# Altium project Pi Zero Avionics Rev3.PrjPCB (part 1 of 2)
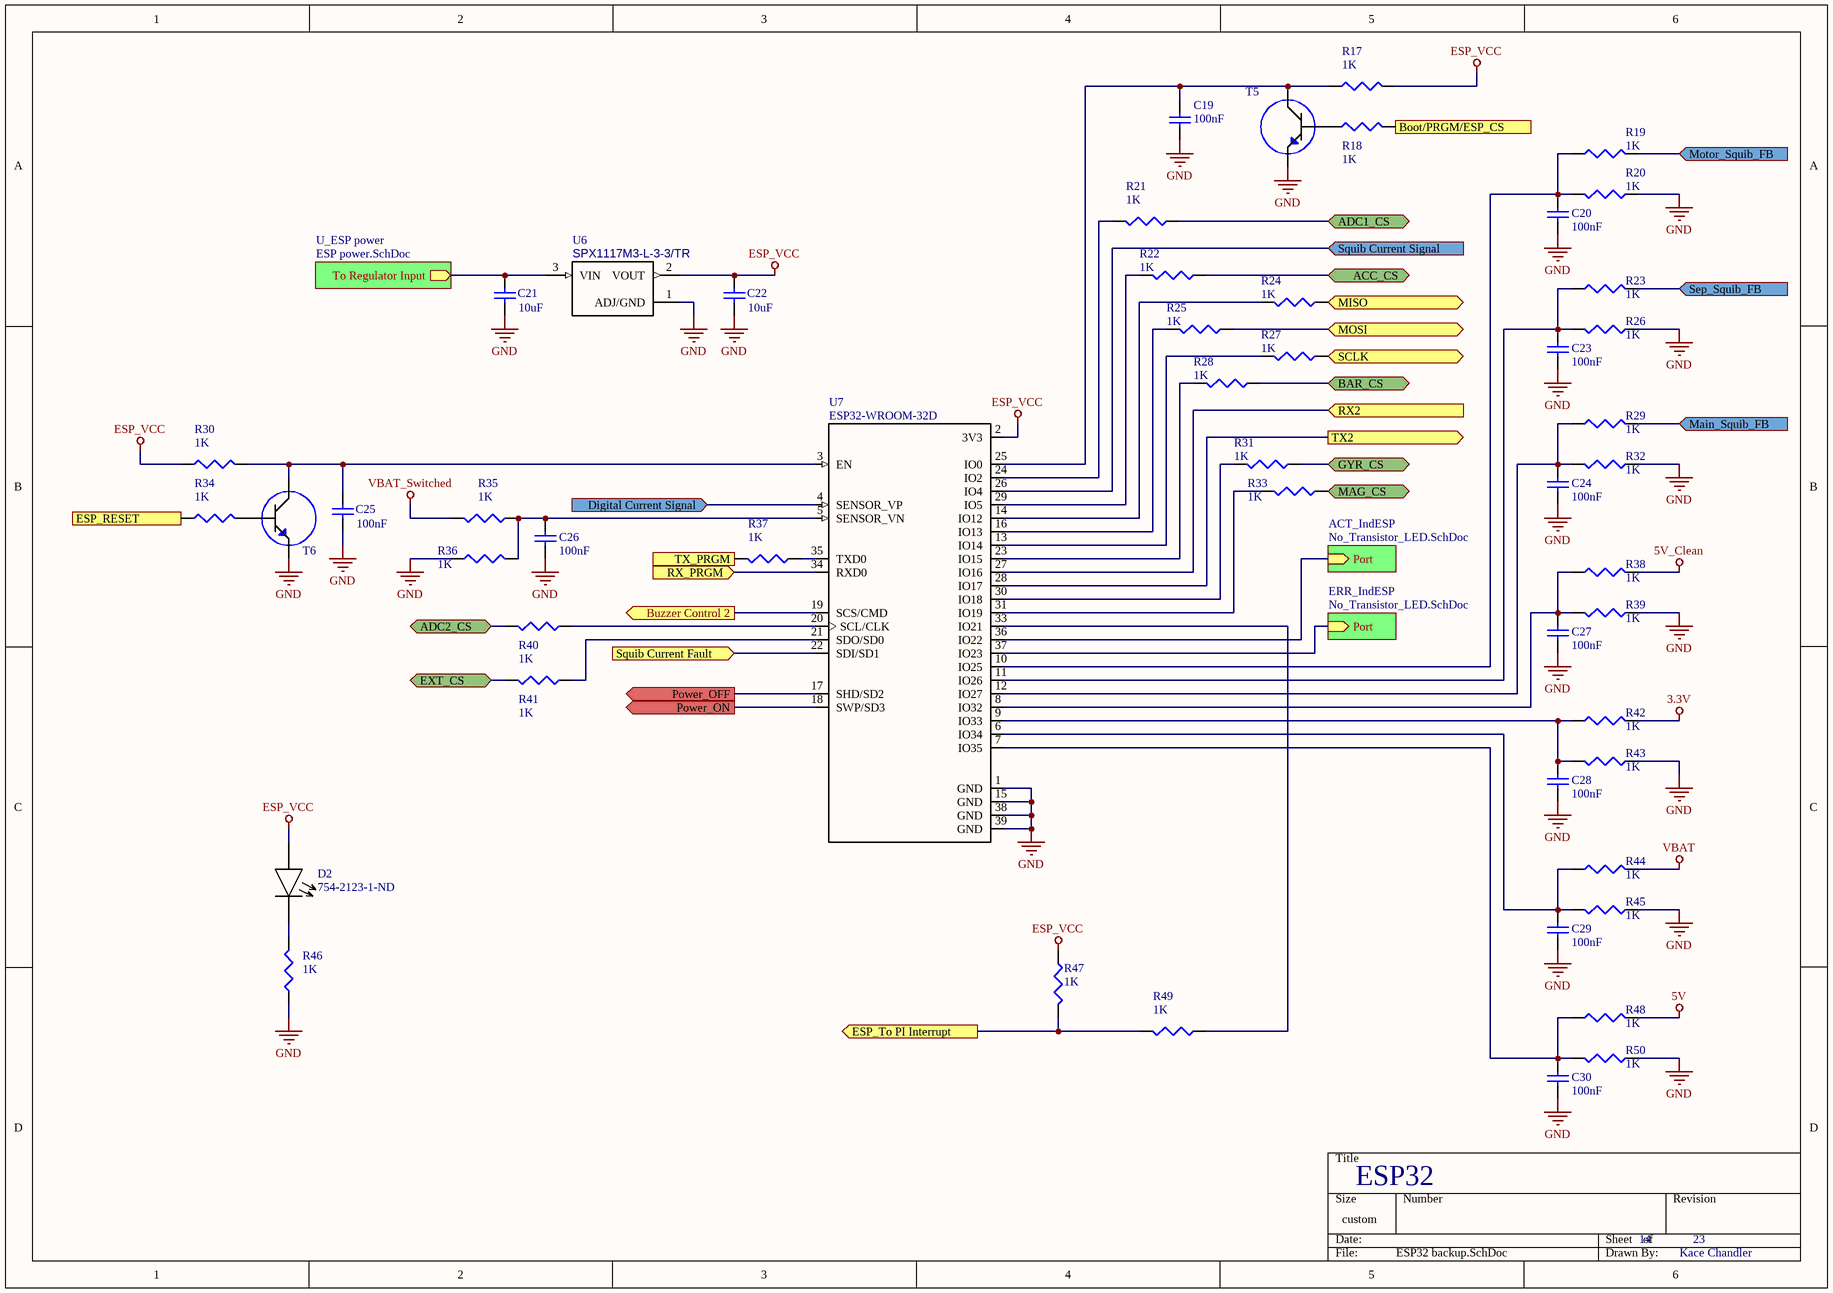
[diagram p0: ESP32 backup.SchDoc]
24 sheets, 377 parts. Net scope: hierarchical (ports join the sheet entries above them; power ports are global).
Board files: HAT PCB.PcbDoc, Main.PcbDoc
Sheets:
  ESP32 backup.SchDoc
    U_ESP power = ESP power.SchDoc
    ACT_IndESP = No_Transistor_LED.SchDoc
    ERR_IndESP = No_Transistor_LED.SchDoc
  Main.SchDoc
    Buzzer = Buzzer.SchDoc
    Sensor Array = Sensors.SchDoc
      Accelerometer = Accelerometer.SchDoc
      Barometer = Barometer.SchDoc
      Gyroscope = Gyroscope.SchDoc
      Magnetometer = Magnetometer.SchDoc
      ADC 1 = ADC.SchDoc
        AIN2 = ADC RC Network.SchDoc
        AIN3 = ADC RC Network.SchDoc
        AIN0 = ADC RC Network.SchDoc
        AIN1 = ADC RC Network.SchDoc
      ADC 2 = ADC.SchDoc
        AIN2 = ADC RC Network.SchDoc
        AIN3 = ADC RC Network.SchDoc
        AIN0 = ADC RC Network.SchDoc
        AIN1 = ADC RC Network.SchDoc
    PWR = Power Managment.SchDoc
      U_Power IO = Power IO.SchDoc
      Regulators = Regulators.SchDoc
    ESP = ESP32.SchDoc
      U_ESP power = ESP power.SchDoc
      ACT_IndESP = No_Transistor_LED.SchDoc
      ERR_IndESP = No_Transistor_LED.SchDoc
    UART = 3 way uart switch.SchDoc
    Squib_Managment = Squib_Managment.SchDoc
      Main_Squib = Squibs.SchDoc
        Voltage_Indicator = Transistor_LED.SchDoc
      Sep_Squib = Squibs.SchDoc
        Voltage_Indicator = Transistor_LED.SchDoc
      Motor_Squib = Squibs.SchDoc
        Voltage_Indicator = Transistor_LED.SchDoc
    ERR_IndPi = No_Transistor_LED.SchDoc
    Main_IND = No_Transistor_LED_INV.SchDoc
    Motor_IND = No_Transistor_LED_INV.SchDoc
    Sep_IND = No_Transistor_LED_INV.SchDoc
    ACT_IND = No_Transistor_LED_INV.SchDoc
    SPI Output = SPI Output.SchDoc
    ESP UART Output = UART Output.SchDoc
    UART EXT = UART Output.SchDoc
    U_EEPROM = EEPROM.SchDoc

## Sheet ESP32 backup.SchDoc: ESP32
size 342 x 241 mm; DrawnBy: Kace Chandler; DocumentNumber: 14; SheetNumber: 14; SheetTotal: 23

### Parts
C19  value 100nF  [0805 Footprint]  (hidden comment: Cap)
C20  value 100nF  [0603 Footprint]  (hidden comment: Cap)
C21  value 10uF  [0805 Footprint]  (hidden comment: Cap)
C22  value 10uF  [0805 Footprint]  (hidden comment: Cap)
C23  value 100nF  [0603 Footprint]  (hidden comment: Cap)
C24  value 100nF  [0603 Footprint]  (hidden comment: Cap)
C25  value 100nF  [0805 Footprint]  (hidden comment: Cap)
C26  value 100nF  [0603 Footprint]  (hidden comment: Cap)
C27  value 100nF  [0603 Footprint]  (hidden comment: Cap)
C28  value 100nF  [0603 Footprint]  (hidden comment: Cap)
C29  value 100nF  [0603 Footprint]  (hidden comment: Cap)
C30  value 100nF  [0603 Footprint]  (hidden comment: Cap)
D2  Supplier Part Number 1: 754-2123-1-ND  [0402 footprint]  (hidden comment: LED_R)
R17  value 1K  (hidden comment: Res3)
R18  value 1K  (hidden comment: Res3)
R19  value 1K  (hidden comment: Res3)
R20  value 1K  (hidden comment: Res3)
R21  value 1K  (hidden comment: Res3)
R22  value 1K  (hidden comment: Res3)
R23  value 1K  (hidden comment: Res3)
R24  value 1K  (hidden comment: Res3)
R25  value 1K  (hidden comment: Res3)
R26  value 1K  (hidden comment: Res3)
R27  value 1K  (hidden comment: Res3)
R28  value 1K  (hidden comment: Res3)
R29  value 1K  (hidden comment: Res3)
R30  value 1K  (hidden comment: Res3)
R31  value 1K  (hidden comment: Res3)
R32  value 1K  (hidden comment: Res3)
R33  value 1K  (hidden comment: Res3)
R34  value 1K  (hidden comment: Res3)
R35  value 1K  (hidden comment: Res3)
R36  value 1K  (hidden comment: Res3)
R37  value 1K  (hidden comment: Res3)
R38  value 1K  (hidden comment: Res3)
R39  value 1K  (hidden comment: Res3)
R40  value 1K  (hidden comment: Res3)
R41  value 1K  (hidden comment: Res3)
R42  value 1K  (hidden comment: Res3)
R43  value 1K  (hidden comment: Res3)
R44  value 1K  (hidden comment: Res3)
R45  value 1K  (hidden comment: Res3)
R46  value 1K  (hidden comment: Res3)
R47  value 1K  [J1-0603]  (hidden comment: Res3)
R48  value 1K  (hidden comment: Res3)
R49  value 1K  (hidden comment: Res3)
R50  value 1K  (hidden comment: Res3)
T5  MMBT2222ALT1  [BJT]  (value not drawn)
T6  MMBT2222ALT1  [BJT]  (value not drawn)
U6  MP: SPX1117M3-L-3-3/TR  [*DPAK229P990X238-4N]  (hidden comment: 3.3V Regulator)
U7  ESP32-WROOM-32D  [*MODULE_ESP32-WROOM-32D]

### Sub-sheets
ACT_IndESP = No_Transistor_LED.SchDoc: Port (in)
ERR_IndESP = No_Transistor_LED.SchDoc: Port (in)
U_ESP power = ESP power.SchDoc: To Regulator Input (out)

### Ports
ACC_CS (bidir), ADC1_CS (bidir), ADC2_CS (bidir), BAR_CS (bidir), Boot/PRGM/ESP_CS (in), Buzzer Control 2 (out), Digital Current Signal (in), ESP_RESET (in), ESP_To PI Interrupt (out), EXT_CS (bidir), GYR_CS (bidir), MAG_CS (bidir), Main_Squib_FB (in), MISO (bidir), MOSI (bidir), Motor_Squib_FB (in), Power_OFF (out), Power_ON (out), RX2 (in), RX_PRGM (in), SCLK (bidir), Sep_Squib_FB (in), Squib Current Fault (in), Squib Current Signal (in), TX2 (out), TX_PRGM (out)

### Nets
3.3V: R42.2
5V: R48.2
5V_Clean: R38.2
ESP_VCC: C22.2 D2.1 R17.1 R30.1 R47.1 U6.2(VOUT) U7.2(3V3)
GND: C19.1 C20.1 C21.1 C22.1 C23.1 C24.1 C25.1 C26.1 C27.1 C28.1 C29.1 C30.1 R20.1 R26.1 R32.1 R36.1 R39.1 R43.1 R45.1 R46.1 R50.1 T5.2(E) T6.2(E) U6.1(ADJ/GND) U7.1(GND) U7.15(GND) U7.38(GND) U7.39(GND)
VBAT: R44.2
VBAT_Switched: R35.2
NetC19_2: C19.2 R17.2 T5.3(C) U7.25(IO0)
NetC20_2: C20.2 R19.1 R20.2 U7.10(IO25)
NetC21_2: C21.2 U6.3(VIN) ; sheet U_ESP power/To Regulator Input
NetC23_2: C23.2 R23.1 R26.2 U7.11(IO26)
NetC24_2: C24.2 R29.1 R32.2 U7.12(IO27)
NetC25_2: C25.2 R30.2 T6.3(C) U7.3(EN)
NetC26_2: C26.2 R35.1 R36.2 U7.5(SENSOR_VN)
NetC27_2: C27.2 R38.1 R39.2 U7.8(IO32)
NetC28_2: C28.2 R42.1 R43.2 U7.9(IO33)
NetC29_2: C29.2 R44.1 R45.2 U7.6(IO34)
NetC30_2: C30.2 R48.1 R50.2 U7.7(IO35)
NetD1_ACT_IndESP_1: U7.36(IO22) ; sheet ACT_IndESP/Port
NetD1_ERR_IndESP_1: U7.37(IO23) ; sheet ERR_IndESP/Port
NetD2_2: D2.2 R46.2
NetR18_1: R18.1 T5.1(B)
NetR18_2: R18.2 ; port Boot/PRGM/ESP_CS
NetR19_2: R19.2 ; port Motor_Squib_FB
NetR21_1: R21.1 ; port ADC1_CS
NetR21_2: R21.2 U7.24(IO2)
NetR22_1: R22.1 ; port ACC_CS
NetR22_2: R22.2 U7.29(IO5)
NetR23_2: R23.2 ; port Sep_Squib_FB
NetR24_1: R24.1 ; port MISO
NetR24_2: R24.2 U7.14(IO12)
NetR25_1: R25.1 ; port MOSI
NetR25_2: R25.2 U7.16(IO13)
NetR27_1: R27.1 ; port SCLK
NetR27_2: R27.2 U7.13(IO14)
NetR28_1: R28.1 ; port BAR_CS
NetR28_2: R28.2 U7.23(IO15)
NetR29_2: R29.2 ; port Main_Squib_FB
NetR31_1: R31.1 ; port GYR_CS
NetR31_2: R31.2 U7.30(IO18)
NetR33_1: R33.1 ; port MAG_CS
NetR33_2: R33.2 U7.31(IO19)
NetR34_1: R34.1 ; port ESP_RESET
NetR34_2: R34.2 T6.1(B)
NetR37_1: R37.1 U7.35(TXD0)
NetR37_2: R37.2 ; port TX_PRGM
NetR40_1: R40.1 U7.20(SCL/CLK)
NetR40_2: R40.2 ; port ADC2_CS
NetR41_1: R41.1 U7.21(SDO/SD0)
NetR41_2: R41.2 ; port EXT_CS
NetR47_2: R47.2 R49.2 ; port ESP_To PI Interrupt
NetR49_1: R49.1 U7.33(IO21)
NetU7_4: U7.4(SENSOR_VP) ; port Digital Current Signal
NetU7_17: U7.17(SHD/SD2) ; port Power_OFF
NetU7_18: U7.18(SWP/SD3) ; port Power_ON
NetU7_19: U7.19(SCS/CMD) ; port Buzzer Control 2
NetU7_22: U7.22(SDI/SD1) ; port Squib Current Fault
NetU7_26: U7.26(IO4) ; port Squib Current Signal
NetU7_27: U7.27(IO16) ; port RX2
NetU7_28: U7.28(IO17) ; port TX2
NetU7_34: U7.34(RXD0) ; port RX_PRGM

### Library data of the parts
C20-C24 C26-C30 = Cap: Capacitor; Published: 8-Jun-2000; LatestRevisionDate: 17-Jul-2002; LatestRevisionNote: Re-released for DXP Platform.; PackageReference: RAD-0.3; Publisher: Altium Limited; PackageDescription: Radial Cap, Thru-Hole; 2 Leads; 0.3 in Pin Spacing
R17-R50 = Res3: Resistor; Published: 8-Jun-2000; LatestRevisionDate: 29-May-2009; LatestRevisionNote: IPC-7351 Footprint Added.; PackageReference: J1-0603; Publisher: Altium Limited; PackageDescription: Chip Resistor
T5 T6 = BJT NPN: Trans NPN 40V 0.6A SOT23; MF: ON Semiconductor; SnapEDA_Link: https://www.snapeda.com/parts/MMBT2222ALT1/ON%20Semiconductor/view-part/?ref=snap; Price: None; Availability: Unavailable; MP: MMBT2222ALT1; Package: SOT-23 Motorola; Value: *; Supplier 1: Digi-Key; Supplier Part Number 1: MMBT2222ATPMSCT-ND
U6 = 3-3VReg: NCP1117DT33T5GOSCT-ND 3.3V linear regulator; MF: MaxLinear, Inc.; Availability: Unavailable; Price: None; Package: SOT-223 Exar; SnapEDA_Link: https://www.snapeda.com/parts/SPX1117M3-L-3-3/TR/MaxLinear%2C%20Inc./view-part/?ref=snap; Value: *; Supplier 1: Digi-Key; Supplier Part Number 1: NCP1117DT33T5GOSCT-ND
U7 = ESP32-WROOM-32D: IC: SoC; GPIO, I2C, I2S, IR, SD, SDIO, SPI, UART; 2.7Ã·3.6VDC; 20dBm; MF: Espressif Systems; SnapEDA_Link: https://www.snapeda.com/parts/ESP32-WROOM-32D/Espressif%20Systems/view-part/?ref=snap; Availability: Unavailable; Package: Module Espressif Systems; Price: None; MP: ESP32-WROOM-32D; Value: *; Supplier 1: Digi-Key; Supplier Part Number 1: 1904-1023-1-ND
D2 = LED_R: Supplier 1: Digi-Key

## Sheet ESP power.SchDoc: ESP Power Management
size 203 x 127 mm; DrawnBy: Kace Chandler; DocumentNumber: 15; SheetNumber: 15; SheetTotal: 23
Used 2 times, as channels U_ESP power, ESP/U_ESP power. Parts and nets are listed once, with the designators drawn on the sheet.
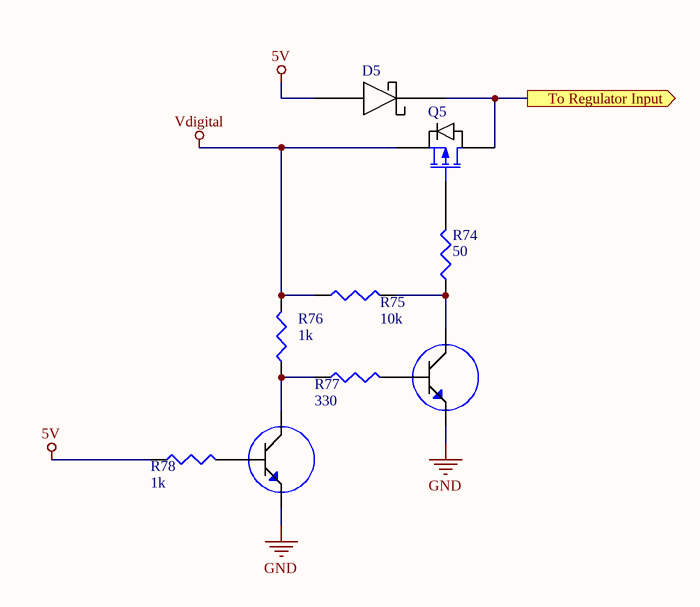
[diagram p1: ESP power.SchDoc]

### Parts
D5  Buck Diode  [*DO-214AC]  (value not drawn)
Q5  P-Channel  [P Channel MOSFET]  (value not drawn)
R74  value 50  [0603 to 0805 SMD]  (hidden comment: Res3)
R75  value 10k  [0603 to 0805 SMD]  (hidden comment: Res3)
R76  value 1k  [0603 to 0805 SMD]  (hidden comment: Res3)
R77  value 330  [0603 to 0805 SMD]  (hidden comment: Res3)
R78  value 1k  [0603 to 0805 SMD]  (hidden comment: Res3)
T10  MMBT2222ALT1  [BJT]  (value not drawn)
T11  MMBT2222ALT1  [BJT]  (value not drawn)

### Ports
To Regulator Input (out)

### Nets
5V: D5.1(A) R78.1
GND: T10.2(E) T11.2(E)
Vdigital: Q5.2(S) R75.1 R76.2
To Regulator Input: D5.2(C) Q5.3(D) ; port To Regulator Input
NetQ5_1: Q5.1(G) R74.2
NetR74_1: R74.1 R75.2 T10.3(C)
NetR76_1: R76.1 R77.1 T11.3(C)
NetR77_2: R77.2 T10.1(B)
NetR78_2: R78.2 T11.1(B)

### Channels
U_ESP power: designators end in _U_ESP_power; ports To Regulator Input=NetC21_2
ESP/U_ESP power: designators end in _ESP_U_ESP_power; ports To Regulator Input=NetC55_2

### Library data of the parts
R74-R78 = Res3: Resistor; Published: 8-Jun-2000; LatestRevisionDate: 29-May-2009; LatestRevisionNote: IPC-7351 Footprint Added.; PackageReference: J1-0603; Publisher: Altium Limited; PackageDescription: Chip Resistor
T10 T11 = BJT NPN: as T5 on sheet ESP32 backup; SnapEDA_Link: https://www.snapeda.com/parts/MMBT2222ALT1/ON%20Semiconductor/view-part/?ref=snap; Price: None; Availability: Unavailable; MP: MMBT2222ALT1; Package: SOT-23 Motorola; Value: *; Supplier 1: Digi-Key; Supplier Part Number 1: MMBT2222ATPMSCT-ND
D5 = Buck Diode: Supplier 1: Digi-Key; Supplier Part Number 1: VSSC8L45-M3/9ATGICT-ND
Q5 = P-Channel: Supplier 1: Digi-Key; Supplier Part Number 1: SI2343CDS-T1-GE3CT-ND

## Sheet No_Transistor_LED.SchDoc: LED
size 203 x 127 mm; DrawnBy: Kace Chandler; DocumentNumber: 16; SheetNumber: 16; SheetTotal: 23
Used 5 times, as channels ACT_IndESP, ERR_IndESP, ESP/ACT_IndESP, ESP/ERR_IndESP, ERR_IndPi. Parts and nets are listed once, with the designators drawn on the sheet.
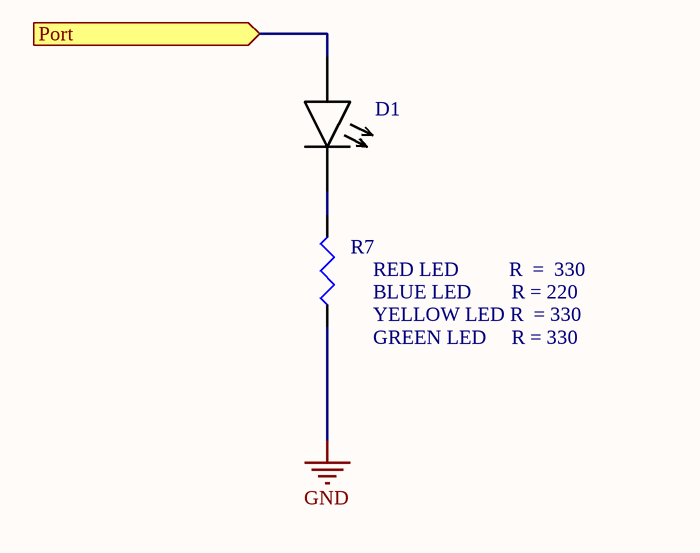
[diagram p2: No_Transistor_LED.SchDoc]

### Parts
D1  LED_R  [0402 footprint]  (value not drawn)
R7  Res3  (value not drawn)

### Ports
Port (in)

### Nets
GND: R7.1
Port: D1.1 ; port Port
NetD1_2: D1.2 R7.2

### Channels
ACT_IndESP: designators end in _ACT_IndESP; ports Port=NetD1_ACT_IndESP_1
ERR_IndESP: designators end in _ERR_IndESP; ports Port=NetD1_ERR_IndESP_1
ESP/ACT_IndESP: designators end in _ESP_ACT_IndESP; ports Port=NetD1_ESP_ACT_IndESP_1
ESP/ERR_IndESP: designators end in _ESP_ERR_IndESP; ports Port=NetD1_ESP_ERR_IndESP_1
ERR_IndPi: designators end in _ERR_IndPi; ports Port=NetD1_ERR_IndPi_1

### Notes on the sheet
- (near R7) RED LED          R  =  330
- (near R7) BLUE LED        R = 220
- (near R7) YELLOW LED R  = 330
- (near R7) GREEN LED     R = 330

### Library data of the parts
R7 = Res3: Resistor; Value: Depends on the color of the LED; Published: 8-Jun-2000; LatestRevisionDate: 29-May-2009; LatestRevisionNote: IPC-7351 Footprint Added.; PackageReference: J1-0603; Publisher: Altium Limited; PackageDescription: Chip Resistor
D1 = LED_R: Supplier 1: Digi-Key; Supplier Part Number 1: 754-2123-1-ND

## Sheet Main.SchDoc: Raspberry Pi - Top Level Schematic
size 406 x 203 mm; DrawnBy: Kace Chandler; DocumentNumber: 1; SheetNumber: 1; SheetTotal: 23
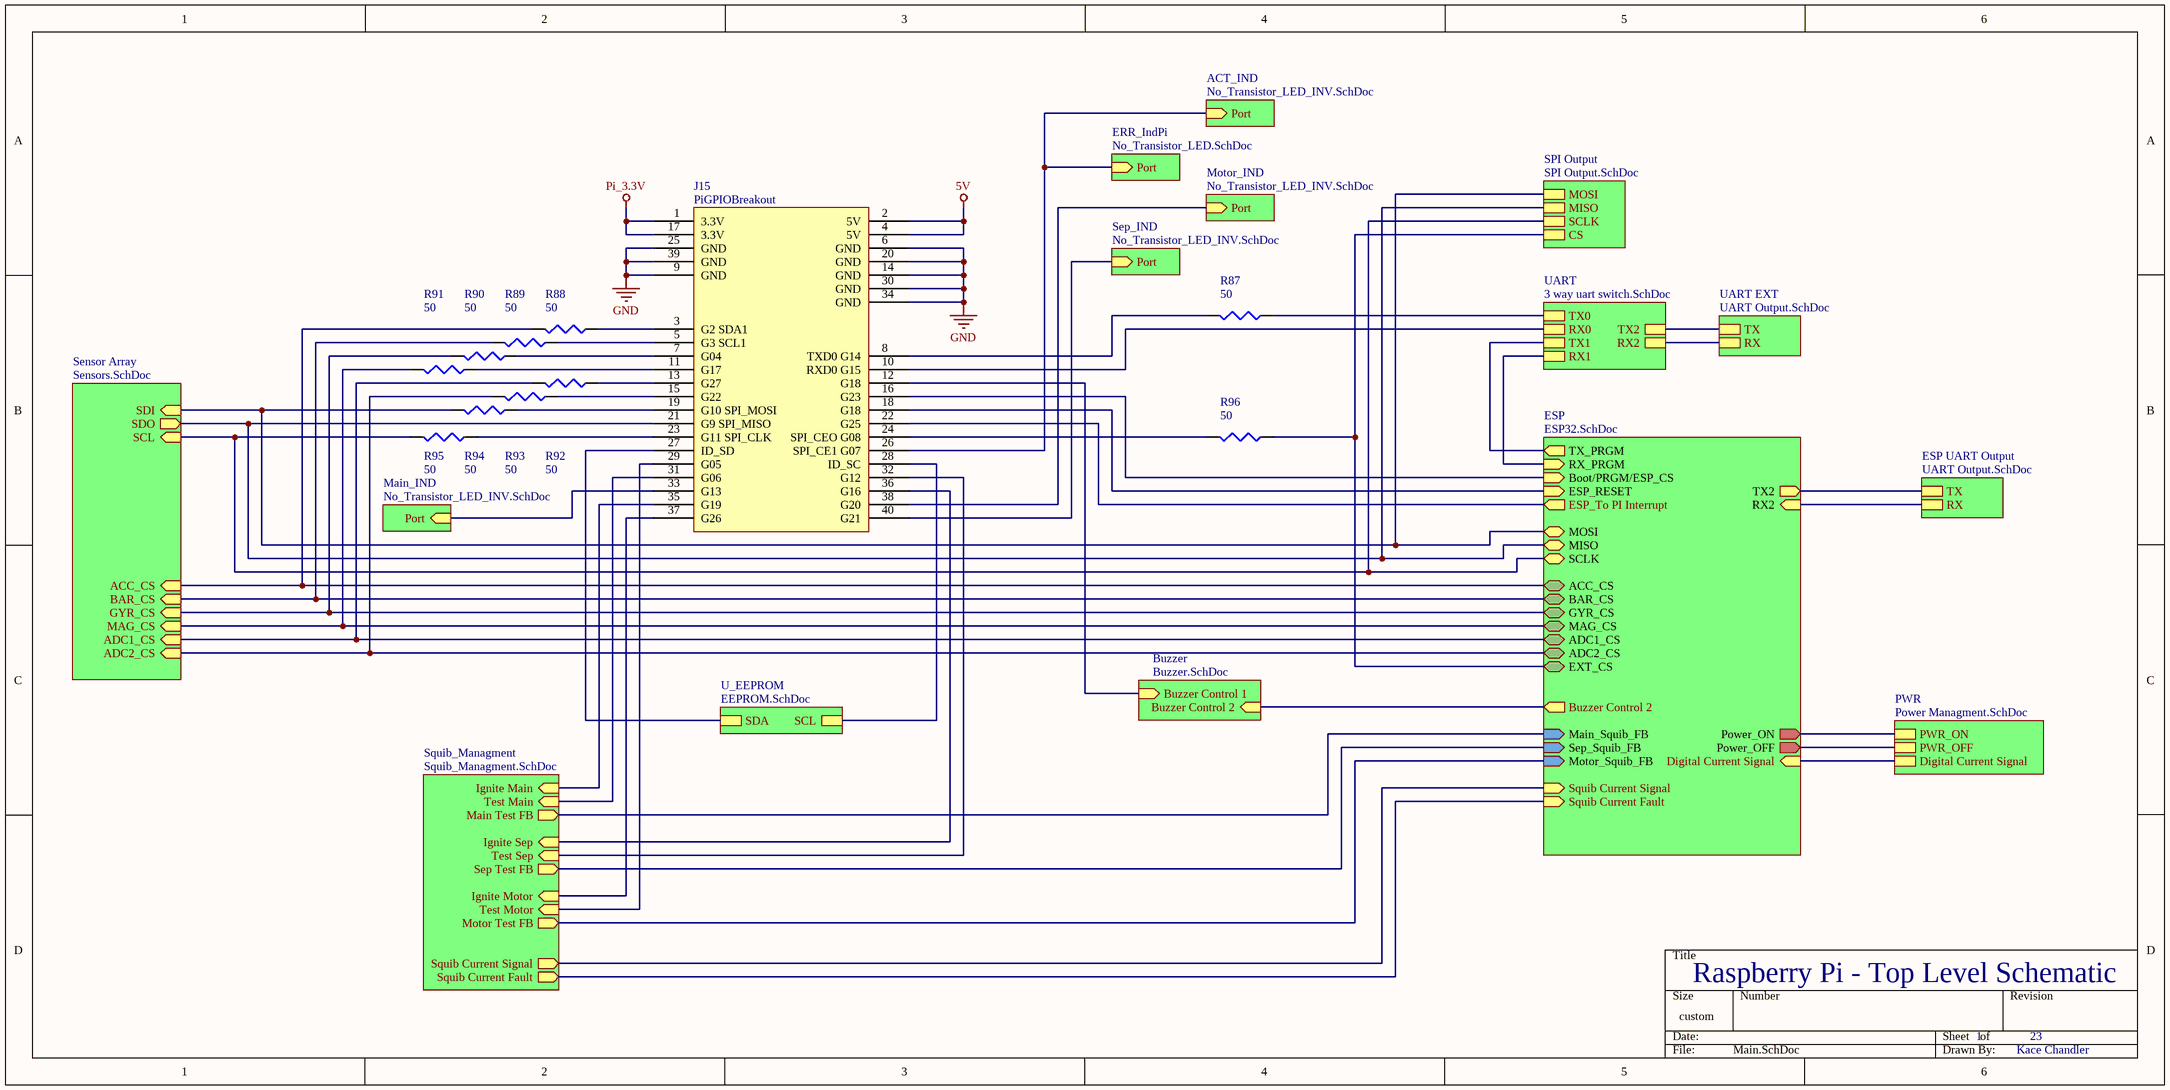
[diagram p3: Main.SchDoc]

### Parts
J15  PiGPIOBreakout  [RPI Through board connector]
R87  value 50  (hidden comment: Res3)
R88  value 50  (hidden comment: Res3)
R89  value 50  (hidden comment: Res3)
R90  value 50  (hidden comment: Res3)
R91  value 50  (hidden comment: Res3)
R92  value 50  (hidden comment: Res3)
R93  value 50  (hidden comment: Res3)
R94  value 50  (hidden comment: Res3)
R95  value 50  (hidden comment: Res3)
R96  value 50  (hidden comment: Res3)

### Sub-sheets
ACT_IND = No_Transistor_LED_INV.SchDoc: Port (in)
Buzzer = Buzzer.SchDoc: Buzzer Control 1 (in), Buzzer Control 2 (in)
ERR_IndPi = No_Transistor_LED.SchDoc: Port (in)
ESP = ESP32.SchDoc: TX_PRGM (out), RX_PRGM (in), Boot/PRGM/ESP_CS (in), RX2 (in), TX2 (out), SCLK (bidir), MISO (bidir), MOSI (bidir), Sep_Squib_FB (in), Main_Squib_FB (in), Motor_Squib_FB (in), Power_ON (out), Power_OFF (out), ACC_CS (bidir), BAR_CS (bidir), GYR_CS (bidir), MAG_CS (bidir), ADC1_CS (bidir), ADC2_CS (bidir), EXT_CS (bidir), ESP_RESET (in), Digital Current Signal (in), Squib Current Signal (in), Squib Current Fault (in), Buzzer Control 2 (out), ESP_To PI Interrupt (out)
ESP UART Output = UART Output.SchDoc: TX, RX
Main_IND = No_Transistor_LED_INV.SchDoc: Port (in)
Motor_IND = No_Transistor_LED_INV.SchDoc: Port (in)
PWR = Power Managment.SchDoc: PWR_ON, PWR_OFF, Digital Current Signal
Sensor Array = Sensors.SchDoc: ACC_CS (in), BAR_CS (in), GYR_CS (in), MAG_CS (in), ADC1_CS (in), ADC2_CS (in), SCL (in), SDO (out), SDI (in)
Sep_IND = No_Transistor_LED_INV.SchDoc: Port (in)
SPI Output = SPI Output.SchDoc: MOSI, MISO, SCLK, CS
Squib_Managment = Squib_Managment.SchDoc: Ignite Main (in), Test Main (in), Main Test FB (out), Ignite Sep (in), Test Sep (in), Sep Test FB (out), Ignite Motor (in), Test Motor (in), Motor Test FB (out), Squib Current Signal (out), Squib Current Fault (out)
U_EEPROM = EEPROM.SchDoc: SDA, SCL
UART = 3 way uart switch.SchDoc: TX1, RX1, TX2, RX2, TX0, RX0
UART EXT = UART Output.SchDoc: TX, RX

### Nets
5V: J15.2(5V) J15.4(5V)
GND: J15.6(GND) J15.9(GND) J15.14(GND) J15.20(GND) J15.25(GND) J15.30(GND) J15.34(GND) J15.39(GND)
Pi_3.3V: J15.1(3.3V) J15.17(3.3V)
MISO: J15.21(G9_SPI_MISO) ; sheet Sensor Array/SDO, sheet ESP/MISO, sheet SPI Output/MISO
MOSI: R94.2 ; sheet Sensor Array/SDI, sheet ESP/MOSI, sheet SPI Output/MOSI
SCL: R95.2 ; sheet Sensor Array/SCL, sheet ESP/SCLK, sheet SPI Output/SCLK
NetC38_2: sheet PWR/Digital Current Signal, sheet ESP/Digital Current Signal
NetC39_2: sheet ESP/Squib Current Signal, sheet Squib_Managment/Squib Current Signal
NetD1_ERR_IndPi_1: J15.26(SPI_CE1_G07) ; sheet ERR_IndPi/Port, sheet ACT_IND/Port
NetD6_Main_IND_2: J15.33(G13) ; sheet Main_IND/Port
NetD6_Motor_IND_2: J15.38(G20) ; sheet Motor_IND/Port
NetD6_Sep_IND_2: J15.40(G21) ; sheet Sep_IND/Port
NetJ3_Main_Squib_1: sheet ESP/Motor_Squib_FB, sheet Squib_Managment/Motor Test FB
NetJ3_Motor_Squib_1: sheet ESP/Main_Squib_FB, sheet Squib_Managment/Main Test FB
NetJ3_Sep_Squib_1: sheet ESP/Sep_Squib_FB, sheet Squib_Managment/Sep Test FB
NetJ15_3: J15.3(G2_SDA1) R88.1
NetJ15_5: J15.5(G3_SCL1) R89.1
NetJ15_7: J15.7(G04) R90.1
NetJ15_8: J15.8(TXD0_G14) R87.2
NetJ15_10: J15.10(RXD0_G15) ; sheet UART/RX0
NetJ15_11: J15.11(G17) R91.1
NetJ15_12: J15.12(G18) ; sheet Buzzer/Buzzer Control 1
NetJ15_13: J15.13(G27) R92.1
NetJ15_15: J15.15(G22) R93.1
NetJ15_16: J15.16(G23) ; sheet ESP/Boot/PRGM/ESP_CS
NetJ15_18: J15.18(G18) ; sheet ESP/ESP_RESET
NetJ15_19: J15.19(G10_SPI_MOSI) R94.1
NetJ15_22: J15.22(G25) ; sheet ESP/ESP_To PI Interrupt
NetJ15_23: J15.23(G11_SPI_CLK) R95.1
NetJ15_24: J15.24(SPI_CEO_G08) R96.2
NetJ15_27: J15.27(ID_SD) ; sheet U_EEPROM/SDA
NetJ15_28: J15.28(ID_SC) ; sheet U_EEPROM/SCL
NetJ15_29: J15.29(G05) ; sheet Squib_Managment/Test Motor
NetJ15_31: J15.31(G06) ; sheet Squib_Managment/Test Main
NetJ15_32: J15.32(G12) ; sheet Squib_Managment/Test Sep
NetJ15_35: J15.35(G19) ; sheet Squib_Managment/Ignite Main
NetJ15_36: J15.36(G16) ; sheet Squib_Managment/Ignite Sep
NetJ15_37: J15.37(G26) ; sheet Squib_Managment/Ignite Motor
NetR2_ADC_1_1: R92.2 ; sheet Sensor Array/ADC1_CS, sheet ESP/ADC1_CS
NetR2_ADC_2_1: R93.2 ; sheet Sensor Array/ADC2_CS, sheet ESP/ADC2_CS
NetR16_1: sheet Buzzer/Buzzer Control 2, sheet ESP/Buzzer Control 2
NetR64_2: sheet PWR/PWR_ON, sheet ESP/Power_ON
NetR67_1: sheet PWR/PWR_OFF, sheet ESP/Power_OFF
NetR71_1: R96.1 ; sheet ESP/EXT_CS, sheet SPI Output/CS
NetR72_ESP_UART_Output_1: sheet ESP/TX2, sheet ESP UART Output/TX
NetR72_UART_EXT_1: sheet UART/TX2, sheet UART EXT/TX
NetR73_ESP_UART_Output_1: sheet ESP/RX2, sheet ESP UART Output/RX
NetR73_UART_EXT_1: sheet UART/RX2, sheet UART EXT/RX
NetR79_1: sheet ESP/Squib Current Fault, sheet Squib_Managment/Squib Current Fault
NetR87_1: R87.1 ; sheet UART/TX0
NetR88_2: R88.2 ; sheet Sensor Array/ACC_CS, sheet ESP/ACC_CS
NetR89_2: R89.2 ; sheet Sensor Array/BAR_CS, sheet ESP/BAR_CS
NetR90_2: R90.2 ; sheet Sensor Array/GYR_CS, sheet ESP/GYR_CS
NetR91_2: R91.2 ; sheet Sensor Array/MAG_CS, sheet ESP/MAG_CS
NetR120_2: sheet ESP/TX_PRGM, sheet UART/TX1
NetS2_3: sheet ESP/RX_PRGM, sheet UART/RX1

### Library data of the parts
R87-R96 = Res3: Resistor; Published: 8-Jun-2000; LatestRevisionDate: 29-May-2009; LatestRevisionNote: IPC-7351 Footprint Added.; PackageReference: J1-0603; Publisher: Altium Limited; PackageDescription: Chip Resistor
J15 = PiGPIOBreakout: Supplier 1: Digi-Key; Supplier Part Number 1: 952-3218-ND

## Sheet Buzzer.SchDoc: Buzzer
size 215 x 139 mm; DrawnBy: Kace Chandler; DocumentNumber: 17; SheetNumber: 17; SheetTotal: 23
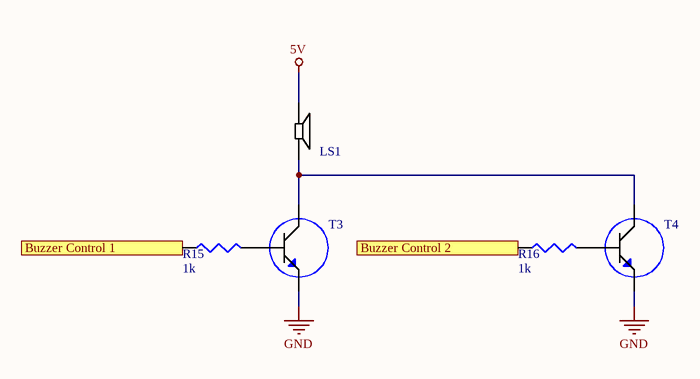
[diagram p4: Buzzer.SchDoc]

### Parts
LS1  CT-1205C-SMT  [CUI_CT-1205C-SMT]  (value not drawn)
R15  value 1k  (hidden comment: Res3)
R16  value 1k  (hidden comment: Res3)
T3  MMBT2222ALT1  [BJT]  (value not drawn)
T4  MMBT2222ALT1  [BJT]  (value not drawn)

### Ports
Buzzer Control 1 (in), Buzzer Control 2 (in)

### Nets
5V: LS1.2
GND: T3.2(E) T4.2(E)
NetJ15_12: R15.1 ; port Buzzer Control 1
NetLS1_1: LS1.1 T3.3(C) T4.3(C)
NetR15_2: R15.2 T3.1(B)
NetR16_1: R16.1 ; port Buzzer Control 2
NetR16_2: R16.2 T4.1(B)

### Library data of the parts
LS1 = Buzzer: MF: CUI Inc.; MP: CT-1205C-SMT-TR; Availability: Unavailable; SnapEDA_Link: https://www.snapeda.com/parts/CT-1205C-SMT-TR/CUI%20Inc./view-part/?ref=snap; Package: CUI; Price: None; Value: *; Supplier 1: Digi-Key; Supplier Part Number 1: 102-1200-1-ND
R15 R16 = Res3: Resistor; Published: 8-Jun-2000; LatestRevisionDate: 29-May-2009; LatestRevisionNote: IPC-7351 Footprint Added.; PackageReference: J1-0603; Publisher: Altium Limited; PackageDescription: Chip Resistor
T3 T4 = BJT NPN: as T5 on sheet ESP32 backup; SnapEDA_Link: https://www.snapeda.com/parts/MMBT2222ALT1/ON%20Semiconductor/view-part/?ref=snap; Price: None; Availability: Unavailable; MP: MMBT2222ALT1; Package: SOT-23 Motorola; Value: *; Supplier 1: Digi-Key; Supplier Part Number 1: MMBT2222ATPMSCT-ND

## Sheet Sensors.SchDoc: Sensor Array Connections
size 203 x 203 mm; DrawnBy: Kace Chandler; DocumentNumber: 2; SheetNumber: 2; SheetTotal: 23
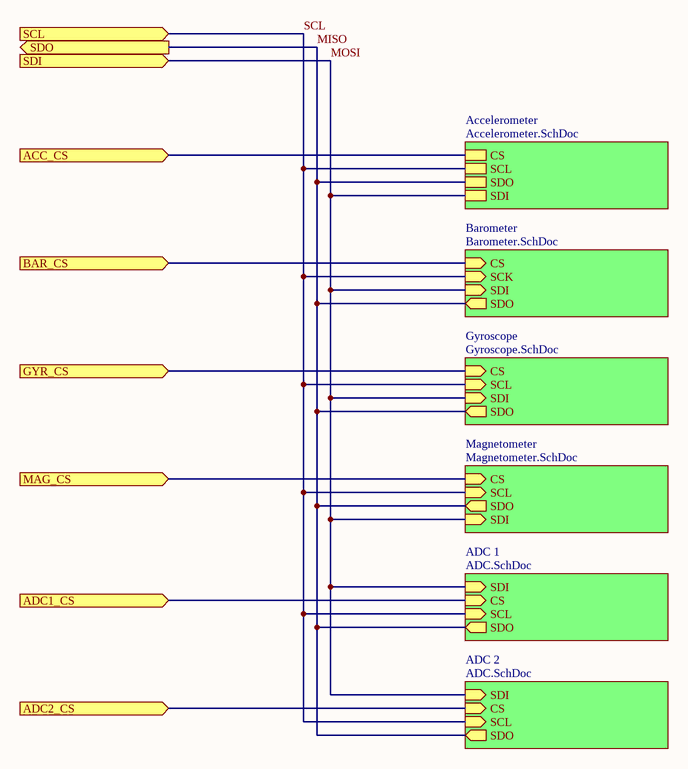
[diagram p5: Sensors.SchDoc]

### Sub-sheets
Accelerometer = Accelerometer.SchDoc: CS, SCL, SDO, SDI
ADC 1 = ADC.SchDoc: SDI (in), CS (in), SCL (in), SDO (out)
ADC 2 = ADC.SchDoc: SDI (in), CS (in), SCL (in), SDO (out)
Barometer = Barometer.SchDoc: CS (in), SCK (in), SDI (in), SDO (out)
Gyroscope = Gyroscope.SchDoc: CS (in), SCL (in), SDI (in), SDO (out)
Magnetometer = Magnetometer.SchDoc: CS (in), SCL (in), SDO (out), SDI (in)

### Ports
ACC_CS (in), ADC1_CS (in), ADC2_CS (in), BAR_CS (in), GYR_CS (in), MAG_CS (in), SCL (in), SDI (in), SDO (out)

### Nets
MISO: port SDO, sheet Accelerometer/SDO, sheet Barometer/SDO, sheet Gyroscope/SDO, sheet Magnetometer/SDO, sheet ADC 1/SDO, sheet ADC 2/SDO
MOSI: port SDI, sheet Accelerometer/SDI, sheet Barometer/SDI, sheet Gyroscope/SDI, sheet Magnetometer/SDI, sheet ADC 1/SDI, sheet ADC 2/SDI
SCL: port SCL, sheet Accelerometer/SCL, sheet Barometer/SCK, sheet Gyroscope/SCL, sheet Magnetometer/SCL, sheet ADC 1/SCL, sheet ADC 2/SCL
NetR2_ADC_1_1: port ADC1_CS, sheet ADC 1/CS
NetR2_ADC_2_1: port ADC2_CS, sheet ADC 2/CS
NetR88_2: port ACC_CS, sheet Accelerometer/CS
NetR89_2: port BAR_CS, sheet Barometer/CS
NetR90_2: port GYR_CS, sheet Gyroscope/CS
NetR91_2: port MAG_CS, sheet Magnetometer/CS

## Sheet Accelerometer.SchDoc: Accelerometer
size 203 x 127 mm; DrawnBy: Kace Chandler; DocumentNumber: 6; SheetNumber: 6; SheetTotal: 23
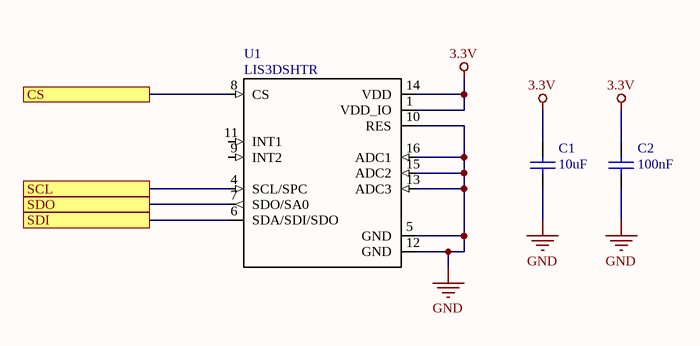
[diagram p6: Accelerometer.SchDoc]

### Parts
C1  value 10uF  [0603 to 1210 SMD]  (hidden comment: Cap)
C2  value 100nF  [0603 to 0805 SMD]  (hidden comment: Cap)
U1  LIS3DSHTR  [L3GD20HTR]

### Ports
CS, SCL, SDI, SDO

### Nets
3.3V: C1.2 C2.2 U1.1(VDD_IO) U1.14(VDD)
GND: C1.1 C2.1 U1.5(GND) U1.10(RES) U1.12(GND) U1.13(ADC3) U1.15(ADC2) U1.16(ADC1)
MISO: U1.7(SDO/SA0) ; port SDO
MOSI: U1.6(SDA/SDI/SDO) ; port SDI
SCL: U1.4(SCL/SPC) ; port SCL
NetR88_2: U1.8(CS) ; port CS

Not connected (* = marked no-connect by the designer): U1 9(INT2) 11(INT1)

### Library data of the parts
U1 = LIS3DSHTR: Accelerometer / MEMS digital output motion sensor: ultra low-power high performance 3-axes nano accelerometer; MF: STMicroelectronics; Price: None; MP: LIS3DSHTR; Availability: Unavailable; SnapEDA_Link: https://www.snapeda.com/parts/LIS3DSHTR/STMicroelectronics/view-part/?ref=snap; Package: LGA-16 STMicroelectronics; Value: *; Supplier 1: Digi-Key; Supplier Part Number 1: 497-13244-1-ND

## Sheet Barometer.SchDoc: Barometer
size 203 x 127 mm; DrawnBy: Kace Chandler; DocumentNumber: 5; SheetNumber: 5; SheetTotal: 23
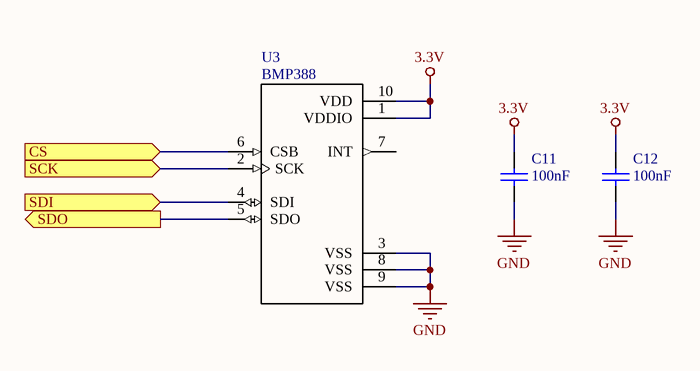
[diagram p7: Barometer.SchDoc]

### Parts
C11  value 100nF  [0603 to 0805 SMD]  (hidden comment: Cap)
C12  value 100nF  [0603 to 0805 SMD]  (hidden comment: Cap)
U3  BMP388  [PQFN50P200X200X80-10N]

### Ports
CS (in), SCK (in), SDI (in), SDO (out)

### Nets
3.3V: C11.2 C12.2 U3.1(VDDIO) U3.10(VDD)
GND: C11.1 C12.1 U3.3(VSS) U3.8(VSS) U3.9(VSS)
MISO: U3.5(SDO) ; port SDO
MOSI: U3.4(SDI) ; port SDI
SCL: U3.2(SCK) ; port SCK
NetR89_2: U3.6(CSB) ; port CS

Not connected (* = marked no-connect by the designer): U3 7(INT)

### Library data of the parts
U3 = BMP388: P-Sensor SPI I2C 1, 25 Bar SMD; MF: Bosch Sensortec; Availability: Unavailable; MP: BMP388; SnapEDA_Link: https://www.snapeda.com/parts/BMP388/Bosch%20Sensortec/view-part/?ref=snap; Package: WFLGA-10 Bosch Tools; Price: None; Value: *; Supplier 1: Digi-Key; Supplier Part Number 1: 828-1079-1-ND

## Sheet Gyroscope.SchDoc: Gyroscope
size 203 x 127 mm; DrawnBy: Kace Chandler; DocumentNumber: 3; SheetNumber: 3; SheetTotal: 23
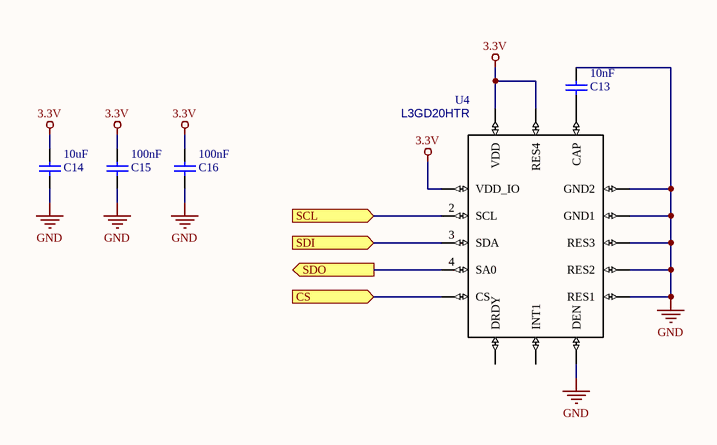
[diagram p8: Gyroscope.SchDoc]

### Parts
C13  value 10nF  [0805 Footprint]  (hidden comment: Cap)
C14  value 10uF  [0805 Footprint]  (hidden comment: Cap)
C15  value 100nF  [0603 to 0805 SMD]  (hidden comment: Cap)
C16  value 100nF  [0603 to 0805 SMD]  (hidden comment: Cap)
U4  L3GD20H  [L3GD20HTR]  (value not drawn)

### Ports
CS (in), SCL (in), SDI (in), SDO (out)

### Nets
3.3V: C14.2 C15.2 C16.2 U4.1(VDD_IO) U4.15(RES4) U4.16(VDD)
GND: C13.2 C14.1 C15.1 C16.1 U4.8(DEN) U4.9(RES1) U4.10(RES2) U4.11(RES3) U4.12(GND1) U4.13(GND2)
MISO: U4.4(SA0) ; port SDO
MOSI: U4.3(SDA) ; port SDI
SCL: U4.2(SCL) ; port SCL
NetC13_1: C13.1 U4.14(CAP)
NetR90_2: U4.5(CS) ; port CS

Not connected (* = marked no-connect by the designer): U4 6(DRDY) 7(INT1)

### Library data of the parts
C14 C15 = Cap: Near VDD
C16 = Cap: Near VDD_IO
U4 = L3GD20H: Gyroscope L3GD20H Series 3.6 V 6.1 mA Three-Axis Digital Output Gyroscope - LGA-16; MF: STMicroelectronics; Price: None; MP: L3GD20HTR; Availability: Unavailable; SnapEDA_Link: https://www.snapeda.com/parts/L3GD20HTR/STMicroelectronics/view-part/?ref=snap; Package: LGA-16 STMicroelectronics; Value: *; Supplier 1: Digi-Key; Supplier Part Number 1: 497-13931-1-ND

## Sheet Magnetometer.SchDoc: Magnetometer
size 203 x 127 mm; DrawnBy: Kace Chandler; DocumentNumber: 4; SheetNumber: 4; SheetTotal: 23
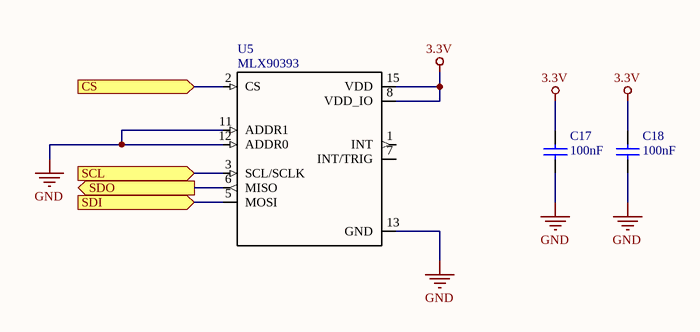
[diagram p9: Magnetometer.SchDoc]

### Parts
C17  value 100nF  [0603 to 0805 SMD]  (hidden comment: Cap)
C18  value 100nF  [0603 to 0805 SMD]  (hidden comment: Cap)
U5  MLX90393  [QFN-16_WITH_AXIES]

### Ports
CS (in), SCL (in), SDI (in), SDO (out)

### Nets
3.3V: C17.2 C18.2 U5.8(VDD_IO) U5.15(VDD)
GND: C17.1 C18.1 U5.11(ADDR1) U5.12(ADDR0) U5.13(GND)
MISO: U5.6(MISO) ; port SDO
MOSI: U5.5(MOSI) ; port SDI
SCL: U5.3(SCL/SCLK) ; port SCL
NetR91_2: U5.2(CS) ; port CS

Not connected (* = marked no-connect by the designer): U5 1(INT) 7(INT/TRIG)

### Library data of the parts
U5 = MLX90393: Magnetometer (Compass); Supplier 1: Digi-Key; Supplier Part Number 1: MLX90393ELW-ABA-011-RECT-ND

## Sheet ADC.SchDoc: Analog to Digital Converter (ADC)
size 254 x 127 mm; DrawnBy: Kace Chandler; DocumentNumber: 7; SheetNumber: 7; SheetTotal: 23
Used 2 times, as channels Sensor Array/ADC 1, Sensor Array/ADC 2. Parts and nets are listed once, with the designators drawn on the sheet.
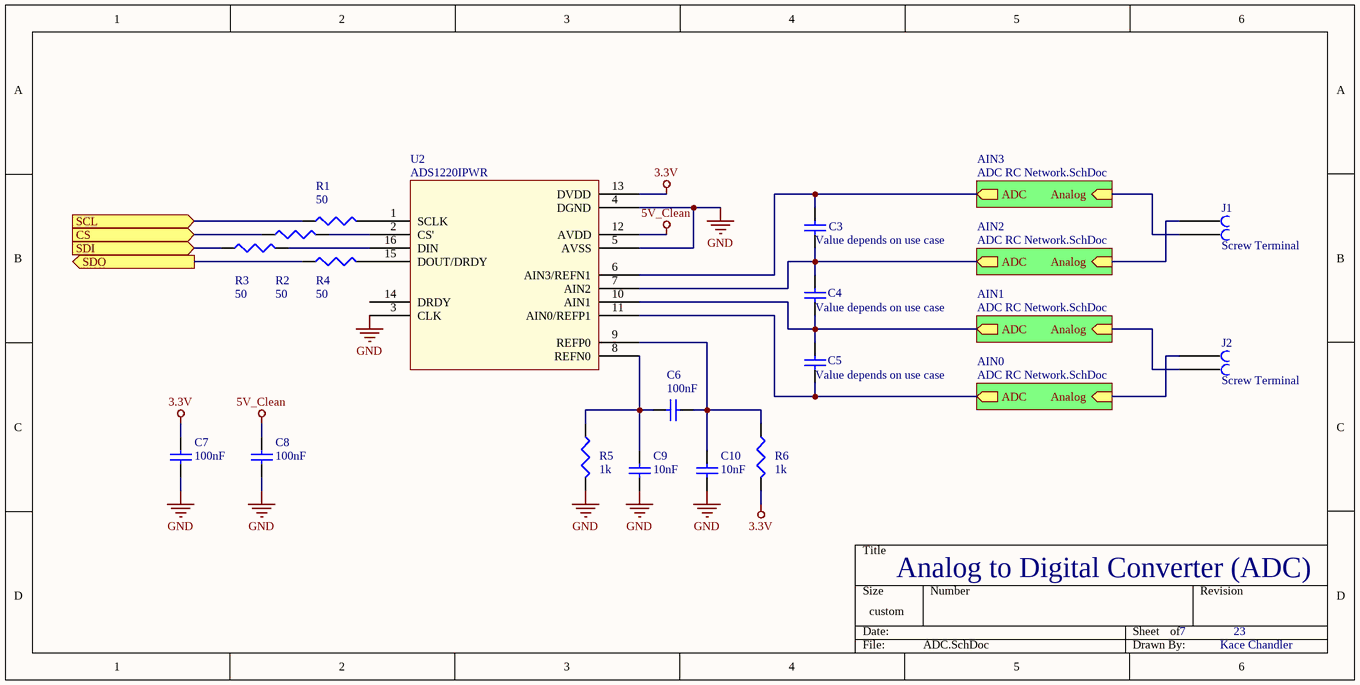
[diagram p10: ADC.SchDoc]

### Parts
C3  value Value depends on use case  [0603 to 0805 SMD]  (hidden comment: Cap)
C4  value Value depends on use case  [0603 to 0805 SMD]  (hidden comment: Cap)
C5  value Value depends on use case  [0603 to 0805 SMD]  (hidden comment: Cap)
C6  value 100nF  [0603 to 0805 SMD]  (hidden comment: Cap)
C7  value 100nF  [0603 Footprint]  (hidden comment: Cap)
C8  value 100nF  [0603 Footprint]  (hidden comment: Cap)
C9  value 10nF  [0603 to 0805 SMD]  (hidden comment: Cap)
C10  value 10nF  [0603 to 0805 SMD]  (hidden comment: Cap)
J1  Screw Terminal  [Screw Terminal]
J2  Screw Terminal  [Screw Terminal]
R1  value 50  (hidden comment: Res3)
R2  value 50  (hidden comment: Res3)
R3  value 50  (hidden comment: Res3)
R4  value 50  (hidden comment: Res3)
R5  value 1k  (hidden comment: Res3)
R6  value 1k  (hidden comment: Res3)
U2  MP: ADS1220IPWR  [SOP65P640X120-16N]  (hidden comment: Analog to Digital Converter)

### Sub-sheets
AIN0 = ADC RC Network.SchDoc: ADC (out), Analog (in)
AIN1 = ADC RC Network.SchDoc: ADC (out), Analog (in)
AIN2 = ADC RC Network.SchDoc: ADC (out), Analog (in)
AIN3 = ADC RC Network.SchDoc: ADC (out), Analog (in)

### Ports
CS (in), SCL (in), SDI (in), SDO (out)

### Nets
3.3V: C7.2 R6.2 U2.13(DVDD)
5V_Clean: C8.2 U2.12(AVDD)
GND: C7.1 C8.1 C9.1 C10.1 R5.2 U2.3(CLK) U2.4(DGND) U2.5(AVSS)
CS: R2.1 ; port CS
SCL: R1.1 ; port SCL
SDI: R3.1 ; port SDI
SDO: R4.1 ; port SDO
NetC3_1: C3.1 C4.1 U2.7(AIN2) ; sheet AIN2/ADC
NetC3_2: C3.2 U2.6(AIN3/REFN1) ; sheet AIN3/ADC
NetC4_2: C4.2 C5.2 U2.10(AIN1) ; sheet AIN1/ADC
NetC5_1: C5.1 U2.11(AIN0/REFP1) ; sheet AIN0/ADC
NetC6_1: C6.1 C9.2 R5.1 U2.8(REFN0)
NetC6_2: C6.2 C10.2 R6.1 U2.9(REFP0)
NetJ1_1: J1.1 ; sheet AIN2/Analog
NetJ1_2: J1.2 ; sheet AIN3/Analog
NetJ2_1: J2.1 ; sheet AIN0/Analog
NetJ2_2: J2.2 ; sheet AIN1/Analog
NetR1_2: R1.2 U2.1(SCLK)
NetR2_2: R2.2 U2.2(CS')
NetR3_2: R3.2 U2.16(DIN)
NetR4_2: R4.2 U2.15(DOUT/DRDY)

Not connected (* = marked no-connect by the designer): U2 14(DRDY)

### Channels
Sensor Array/ADC 1: designators end in _ADC_1; ports CS=NetR2_ADC_1_1 SCL=SCL SDI=MOSI SDO=MISO
Sensor Array/ADC 2: designators end in _ADC_2; ports CS=NetR2_ADC_2_1 SCL=SCL SDI=MOSI SDO=MISO

### Library data of the parts
C3-C5 = Cap: Capacitor; Published: 8-Jun-2000; LatestRevisionDate: 17-Jul-2002; LatestRevisionNote: Re-released for DXP Platform.; PackageReference: RAD-0.3; Publisher: Altium Limited; PackageDescription: Radial Cap, Thru-Hole; 2 Leads; 0.3 in Pin Spacing
R1-R6 = Res3: Resistor; Published: 8-Jun-2000; LatestRevisionDate: 29-May-2009; LatestRevisionNote: IPC-7351 Footprint Added.; PackageReference: J1-0603; Publisher: Altium Limited; PackageDescription: Chip Resistor
U2 = Analog to Digital Converter: SOP65P640X120-16N; Supplier 1: Digi-Key; Supplier Part Number 1: 296-39851-1-ND
J1 J2 = Screw Terminal: Supplier 1: Digi-Key; Supplier Part Number 1: A112762-ND

## Sheet ADC RC Network.SchDoc: ADC Input Network
size 203 x 127 mm; DrawnBy: Kace Chandler; DocumentNumber: 8; SheetNumber: 8; SheetTotal: 23
Used 8 times, as channels Sensor Array/ADC 1/AIN2, Sensor Array/ADC 1/AIN3, Sensor Array/ADC 1/AIN0, Sensor Array/ADC 1/AIN1, Sensor Array/ADC 2/AIN2, Sensor Array/ADC 2/AIN3, Sensor Array/ADC 2/AIN0, Sensor Array/ADC 2/AIN1. Parts and nets are listed once, with the designators drawn on the sheet.
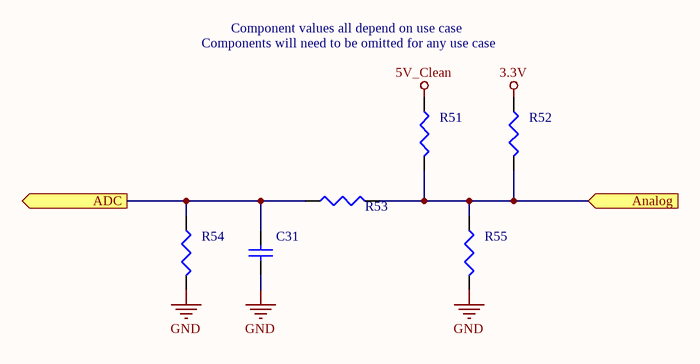
[diagram p11: ADC RC Network.SchDoc]

### Parts
C31  Cap  [0603 to 0805 SMD]  (value not drawn)
R51  Res3  [0603 to 0805 SMD]  (value not drawn)
R52  Res3  [0603 to 0805 SMD]  (value not drawn)
R53  Res3  [0603 to 0805 SMD]  (value not drawn)
R54  Res3  [0603 to 0805 SMD]  (value not drawn)
R55  Res3  [0603 to 0805 SMD]  (value not drawn)

### Ports
ADC (out), Analog (in)

### Nets
3.3V: R52.1
5V_Clean: R51.1
GND: C31.1 R54.2 R55.2
ADC: C31.2 R53.1 R54.1 ; port ADC
Analog: R51.2 R52.2 R53.2 R55.1 ; port Analog

### Channels
Sensor Array/ADC 1/AIN2: designators end in _Sensor_Array_ADC_1_AIN2; ports ADC=NetC3_ADC_1_1 Analog=NetJ1_ADC_1_1
Sensor Array/ADC 1/AIN3: designators end in _Sensor_Array_ADC_1_AIN3; ports ADC=NetC3_ADC_1_2 Analog=NetJ1_ADC_1_2
Sensor Array/ADC 1/AIN0: designators end in _Sensor_Array_ADC_1_AIN0; ports ADC=NetC5_ADC_1_1 Analog=NetJ2_ADC_1_1
Sensor Array/ADC 1/AIN1: designators end in _Sensor_Array_ADC_1_AIN1; ports ADC=NetC4_ADC_1_2 Analog=NetJ2_ADC_1_2
Sensor Array/ADC 2/AIN2: designators end in _Sensor_Array_ADC_2_AIN2; ports ADC=NetC3_ADC_2_1 Analog=NetJ1_ADC_2_1
Sensor Array/ADC 2/AIN3: designators end in _Sensor_Array_ADC_2_AIN3; ports ADC=NetC3_ADC_2_2 Analog=NetJ1_ADC_2_2
Sensor Array/ADC 2/AIN0: designators end in _Sensor_Array_ADC_2_AIN0; ports ADC=NetC5_ADC_2_1 Analog=NetJ2_ADC_2_1
Sensor Array/ADC 2/AIN1: designators end in _Sensor_Array_ADC_2_AIN1; ports ADC=NetC4_ADC_2_2 Analog=NetJ2_ADC_2_2

### Notes on the sheet
- Components will need to be omitted for any use case
- Component values all depend on use case

### Library data of the parts
C31 = Cap: Capacitor; Value: Value depends on use case; Published: 8-Jun-2000; LatestRevisionDate: 17-Jul-2002; LatestRevisionNote: Re-released for DXP Platform.; PackageReference: RAD-0.3; Publisher: Altium Limited; PackageDescription: Radial Cap, Thru-Hole; 2 Leads; 0.3 in Pin Spacing
R51-R55 = Res3: Resistor; Value: Value depends on use case; Published: 8-Jun-2000; LatestRevisionDate: 29-May-2009; LatestRevisionNote: IPC-7351 Footprint Added.; PackageReference: J1-0603; Publisher: Altium Limited; PackageDescription: Chip Resistor

## Sheet Power Managment.SchDoc: Power Managment
size 215 x 139 mm; DrawnBy: Kace Chandler; DocumentNumber: 11; SheetNumber: 11; SheetTotal: 23
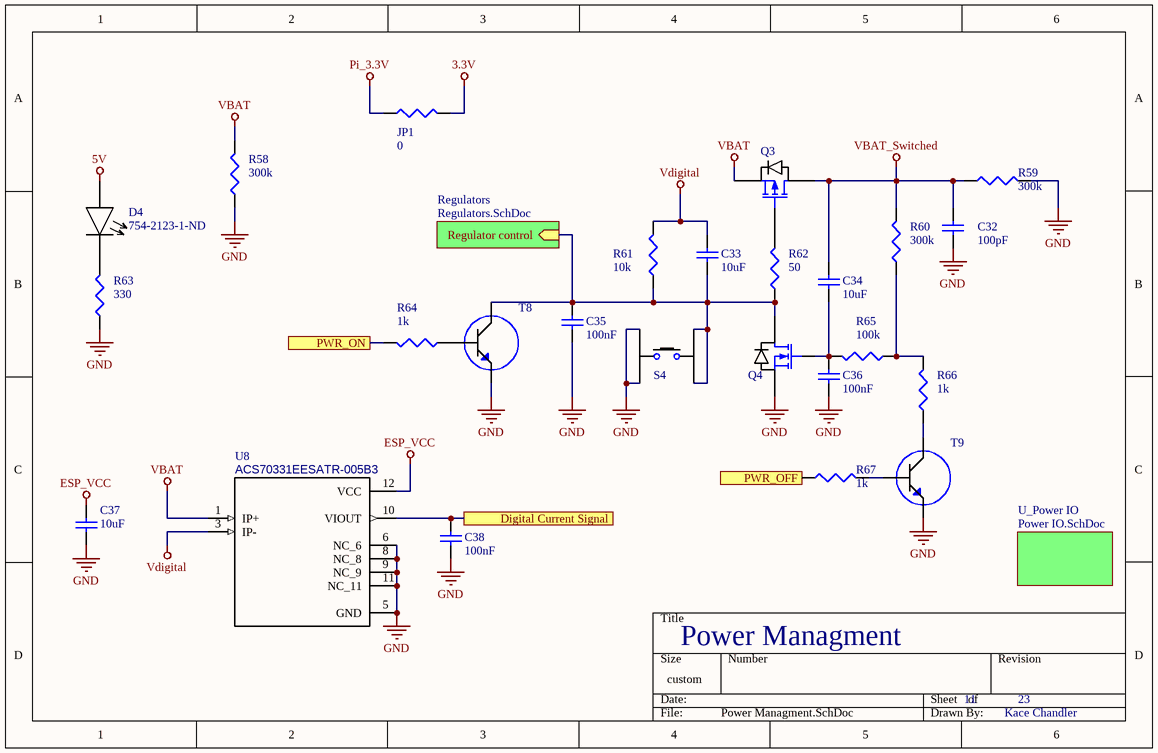
[diagram p12: Power Managment.SchDoc]

### Parts
C32  value 100pF  [Electrolytic Cap]  (hidden comment: Cap)
C33  value 10uF  [0603 to 0805 SMD]  (hidden comment: Cap)
C34  value 10uF  [0603 to 0805 SMD]  (hidden comment: Cap)
C35  value 100nF  [0603 to 0805 SMD]  (hidden comment: Cap)
C36  value 100nF  [0603 to 0805 SMD]  (hidden comment: Cap)
C37  value 10uF  [0805 Footprint]  (hidden comment: Cap)
C38  value 100nF  [0805 Footprint]  (hidden comment: Cap)
D4  Supplier Part Number 1: 754-2123-1-ND  [0402 footprint]  (hidden comment: LED_R)
JP1  value 0  [0603 TO 1210 SMD]  (hidden comment: Res3)
Q3  P-Channel  [P Channel MOSFET]  (value not drawn)
Q4  N-Channel  [N Channel MOSFET]  (value not drawn)
R58  value 300k  [0603 Footprint]  (hidden comment: Res3)
R59  value 300k  [0603 Footprint]  (hidden comment: Res3)
R60  value 300k  [0603 Footprint]  (hidden comment: Res3)
R61  value 10k  [0603 Footprint]  (hidden comment: Res3)
R62  value 50  [0603 Footprint]  (hidden comment: Res3)
R63  value 330  [0603 Footprint]  (hidden comment: Res3)
R64  value 1k  [0603 Footprint]  (hidden comment: Res3)
R65  value 100k  [0603 Footprint]  (hidden comment: Res3)
R66  value 1k  [0603 Footprint]  (hidden comment: Res3)
R67  value 1k  [0603 Footprint]  (hidden comment: Res3)
S4  434153017835  [*434153017835]  (value not drawn)
T8  MMBT2222ALT1  [BJT]  (value not drawn)
T9  MMBT2222ALT1  [BJT]  (value not drawn)
U8  ACS70331EESATR-005B3  [*XDCR_ACS70331EESATR-005B3]

### Sub-sheets
Regulators = Regulators.SchDoc: Regulator control (in)
U_Power IO = Power IO.SchDoc: no entries

### Ports
Digital Current Signal, PWR_OFF, PWR_ON

### Nets
3.3V: JP1.2
5V: D4.1
ESP_VCC: C37.2 U8.12(VCC)
GND: C32.1 C35.1 C36.1 C37.1 C38.1 Q4.2(S) R58.1 R59.2 R63.1 S4.2 S4.4 T8.2(E) T9.2(E) U8.5(GND) U8.6(NC_6) U8.8(NC_8) U8.9(NC_9) U8.11(NC_11)
Pi_3.3V: JP1.1
VBAT: Q3.2(S) R58.2 U8.1(IP+)
VBAT_Switched: C32.2 C34.2 Q3.3(D) R59.1 R60.2
Vdigital: C33.2 R61.2 U8.3(IP-)
NetC33_1: C33.1 C35.2 Q4.3(D) R61.1 R62.1 S4.1 S4.3 T8.3(C) ; sheet Regulators/Regulator control
NetC34_1: C34.1 C36.2 Q4.1(G) R65.2
NetC38_2: C38.2 U8.10(VIOUT) ; port Digital Current Signal
NetD4_2: D4.2 R63.2
NetQ3_1: Q3.1(G) R62.2
NetR60_1: R60.1 R65.1 R66.2
NetR64_1: R64.1 T8.1(B)
NetR64_2: R64.2 ; port PWR_ON
NetR66_1: R66.1 T9.3(C)
NetR67_1: R67.1 ; port PWR_OFF
NetR67_2: R67.2 T9.1(B)

### Library data of the parts
C32-C38 = Cap: Capacitor; Published: 8-Jun-2000; LatestRevisionDate: 17-Jul-2002; LatestRevisionNote: Re-released for DXP Platform.; PackageReference: RAD-0.3; Publisher: Altium Limited; PackageDescription: Radial Cap, Thru-Hole; 2 Leads; 0.3 in Pin Spacing
JP1 R58-R67 = Res3: Resistor; Published: 8-Jun-2000; LatestRevisionDate: 29-May-2009; LatestRevisionNote: IPC-7351 Footprint Added.; PackageReference: J1-0603; Publisher: Altium Limited; PackageDescription: Chip Resistor
S4 = Pushbutton NO: Switch Tactile Spst-No 0.05a 12v; MF: Wurth Electronics; Price: None; Package: None; Availability: Unavailable; SnapEDA_Link: https://www.snapeda.com/parts/434153017835/Wurth%20Electronics%20Inc./view-part/?ref=snap; MP: 434153017835; Value: *; Supplier 1: Digi-Key; Supplier Part Number 1: 732-10143-1-ND
T8 T9 = BJT NPN: as T5 on sheet ESP32 backup; SnapEDA_Link: https://www.snapeda.com/parts/MMBT2222ALT1/ON%20Semiconductor/view-part/?ref=snap; Price: None; Availability: Unavailable; MP: MMBT2222ALT1; Package: SOT-23 Motorola; Value: *; Supplier 1: Digi-Key; Supplier Part Number 1: MMBT2222ATPMSCT-ND
U8 = 2.5A Current Sensor: Current Sensor Current Sensor AC/DC Current 12-Pin QFN EP T/R; MF: Allegro MicroSystems LLC; Availability: Unavailable; Package: WFQFN-12 Allegro MicroSystems LLC; Price: None; SnapEDA_Link: https://www.snapeda.com/parts/ACS70331EESATR-005B3/Allegro%20MicroSystems%20LLC/view-part/?ref=snap; MP: ACS70331EESATR-005B3; Value: *; Supplier 1: Digi-Key; Supplier Part Number 1: 620-1890-1-ND
D4 = LED_R: Supplier 1: Digi-Key
Q3 = P-Channel: Supplier 1: Digi-Key; Supplier Part Number 1: SI2343CDS-T1-GE3CT-ND
Q4 = N-Channel: Supplier 1: Digi-Key; Supplier Part Number 1: SI2338DS-T1-GE3CT-ND

## Sheet Power IO.SchDoc: Power Input/Output
size 203 x 127 mm; DrawnBy: Kace Chandler; DocumentNumber: 13; SheetNumber: 13; SheetTotal: 23
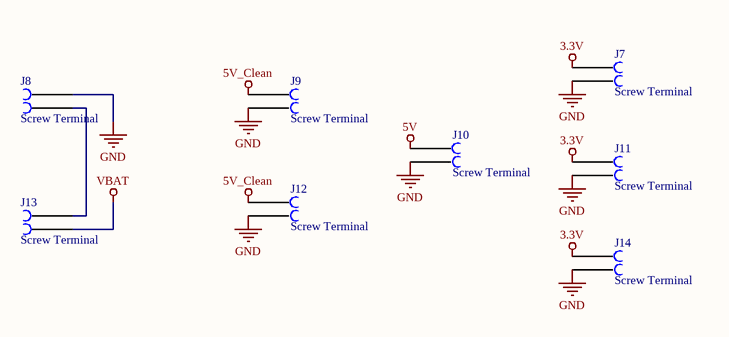
[diagram p13: Power IO.SchDoc]

### Parts
J7  Screw Terminal  [Screw Terminal]
J8  Screw Terminal  [Screw Terminal]
J9  Screw Terminal  [Screw Terminal]
J10  Screw Terminal  [Screw Terminal]
J11  Screw Terminal  [Screw Terminal]
J12  Screw Terminal  [Screw Terminal]
J13  Screw Terminal  [Screw Terminal]
J14  Screw Terminal  [Screw Terminal]

### Nets
3.3V: J7.1 J11.1 J14.1
5V: J10.1
5V_Clean: J9.1 J12.1
GND: J7.2 J8.2 J9.2 J10.2 J11.2 J12.2 J14.2
VBAT: J13.1
NetJ8_1: J8.1 J13.2

### Library data of the parts
J7-J14 = Screw Terminal: Supplier 1: Digi-Key; Supplier Part Number 1: A112762-ND

## Sheet Regulators.SchDoc: Voltage Regulators
size 228 x 152 mm; DrawnBy: Kace Chandler; DocumentNumber: 12; SheetNumber: 12; SheetTotal: 23
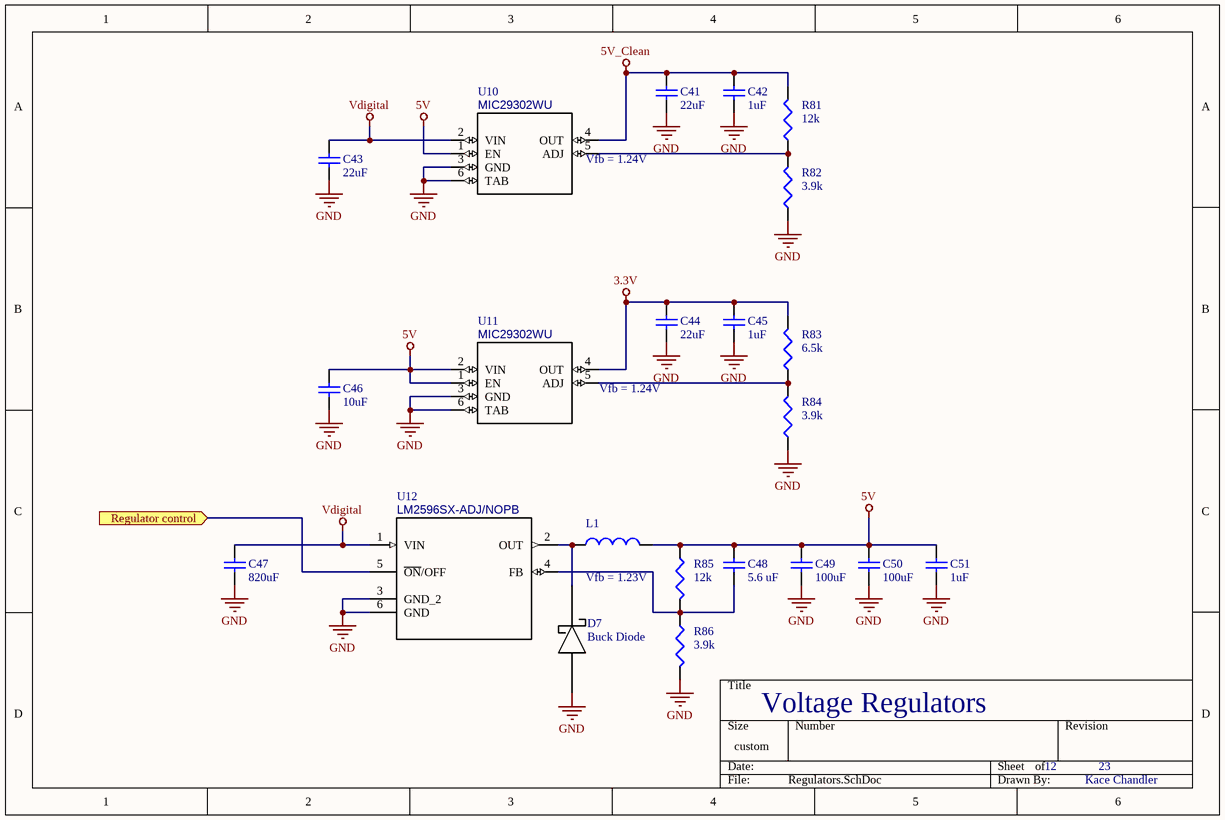
[diagram p14: Regulators.SchDoc]

### Parts
C41  value 22uF  [0603 to 1210 SMD]  (hidden comment: Cap)
C42  value 1uF  [0603 to 0805 SMD]  (hidden comment: Cap)
C43  value 22uF  [0603 to 1210 SMD]  (hidden comment: Cap)
C44  value 22uF  [0603 to 1210 SMD]  (hidden comment: Cap)
C45  value 1uF  [0603 to 0805 SMD]  (hidden comment: Cap)
C46  value 10uF  [0805 Footprint]  (hidden comment: Cap)
C47  value 820uF  [Electrolytic Cap]  (hidden comment: Cap)
C48  value 5.6 uF  [0603 to 1210 SMD]  (hidden comment: Cap)
C49  value 100uF  [0603 to 1210 SMD]  (hidden comment: Cap)
C50  value 100uF  [0603 to 1210 SMD]  (hidden comment: Cap)
C51  value 1uF  [0603 to 0805 SMD]  (hidden comment: Cap)
D7  Buck Diode  [*DO-214AC]
L1  7447709330  [INDUCTOR]  (value not drawn)
R81  value 12k  (hidden comment: Res3)
R82  value 3.9k  (hidden comment: Res3)
R83  value 6.5k  (hidden comment: Res3)
R84  value 3.9k  (hidden comment: Res3)
R85  value 12k  (hidden comment: Res3)
R86  value 3.9k  (hidden comment: Res3)
U10  MP: MIC29302WU  [*TO170P1435X465-6N]  (hidden comment: Linear Regulator)
U11  MP: MIC29302WU  [*TO170P1435X465-6N]  (hidden comment: Linear Regulator)
U12  LM2596SX-ADJ/NOPB  [*TO170P1435X465-6N]

### Ports
Regulator control (in)

### Nets
3.3V: C44.2 C45.2 R83.2 U11.4(OUT)
5V: C46.2 C48.2 C49.2 C50.2 C51.2 L1.2 R85.1 U10.1(EN) U11.1(EN) U11.2(VIN)
5V_Clean: C41.2 C42.2 R81.2 U10.4(OUT)
GND: C41.1 C42.1 C43.1 C44.1 C45.1 C46.1 C47.1 C49.1 C50.1 C51.1 D7.1(A) R82.1 R84.1 R86.2 U10.3(GND) U10.6(TAB) U11.3(GND) U11.6(TAB) U12.3(GND_2) U12.6(GND)
Vdigital: C43.2 C47.2 U10.2(VIN) U12.1(VIN)
NetC33_1: U12.5(~{ON}/OFF) ; port Regulator control
NetC48_1: C48.1 R85.2 R86.1 U12.4(FB)
NetD7_2: D7.2(C) L1.1 U12.2(OUT)
NetR81_1: R81.1 R82.2 U10.5(ADJ)
NetR83_1: R83.1 R84.2 U11.5(ADJ)

### Notes on the sheet
- (near U10) Vfb = 1.24V
- (near U11) Vfb = 1.24V
- Vfb = 1.23V

### Library data of the parts
C41-C51 = Cap: Capacitor; Published: 8-Jun-2000; LatestRevisionDate: 17-Jul-2002; LatestRevisionNote: Re-released for DXP Platform.; PackageReference: RAD-0.3; Publisher: Altium Limited; PackageDescription: Radial Cap, Thru-Hole; 2 Leads; 0.3 in Pin Spacing
L1 = Buck Inductor: Inductor, SMD [WÃ¼rth Elektronik] 7447709330 Inductor, SMD; MF: Wurth Electronics; MP: 7447709330; Availability: Unavailable; SnapEDA_Link: https://www.snapeda.com/parts/7447709330/Wurth%20Electronics%20Inc./view-part/?ref=snap; Price: None; Package: 1210 WÃ¼rth Elektronik; Value: *; Supplier 1: Digi-Key; Supplier Part Number 1: 732-1244-6-ND
R81-R86 = Res3: Resistor; Published: 8-Jun-2000; LatestRevisionDate: 29-May-2009; LatestRevisionNote: IPC-7351 Footprint Added.; PackageReference: J1-0603; Publisher: Altium Limited; PackageDescription: Chip Resistor
U10 U11 = Linear Regulator: MIC29302 Series 3 A 1.24 to 26 V ADJ Output Voltage LDO Regulator - TO-263-5; MF: Microchip; Package: TO-263-5 Microchip; Availability: Unavailable; SnapEDA_Link: https://www.snapeda.com/parts/MIC29302WU/Microchip/view-part/?ref=snap; Price: None; Value: *; Supplier 1: Digi-Key; Supplier Part Number 1: 576-1125-1-ND
U12 = Switching Regulator ADJ: SIMPLE SWITCHERÂ® 4.5V to 40V, 3A Low Component Count Step-Down Regulator 5-DDPAK/TO-263 -40 to 125; MF: Texas Instruments; Package: TO-263-6 Texas Instruments; Availability: Unavailable; MP: LM2596SX-ADJ/NOPB; SnapEDA_Link: https://www.snapeda.com/parts/LM2596SX-ADJ/NOPB/Texas%20Instruments/view-part/?ref=snap; Price: None; Value: *; Supplier 1: Digi-Key; Supplier Part Number 1: 296-35399-1-ND
D7 = Buck Diode: Supplier 1: Digi-Key; Supplier Part Number 1: VSSC8L45-M3/9ATGICT-ND

## Sheet ESP32.SchDoc: ESP32
size 342 x 241 mm; DrawnBy: Kace Chandler; DocumentNumber: 14; SheetNumber: 14; SheetTotal: 23
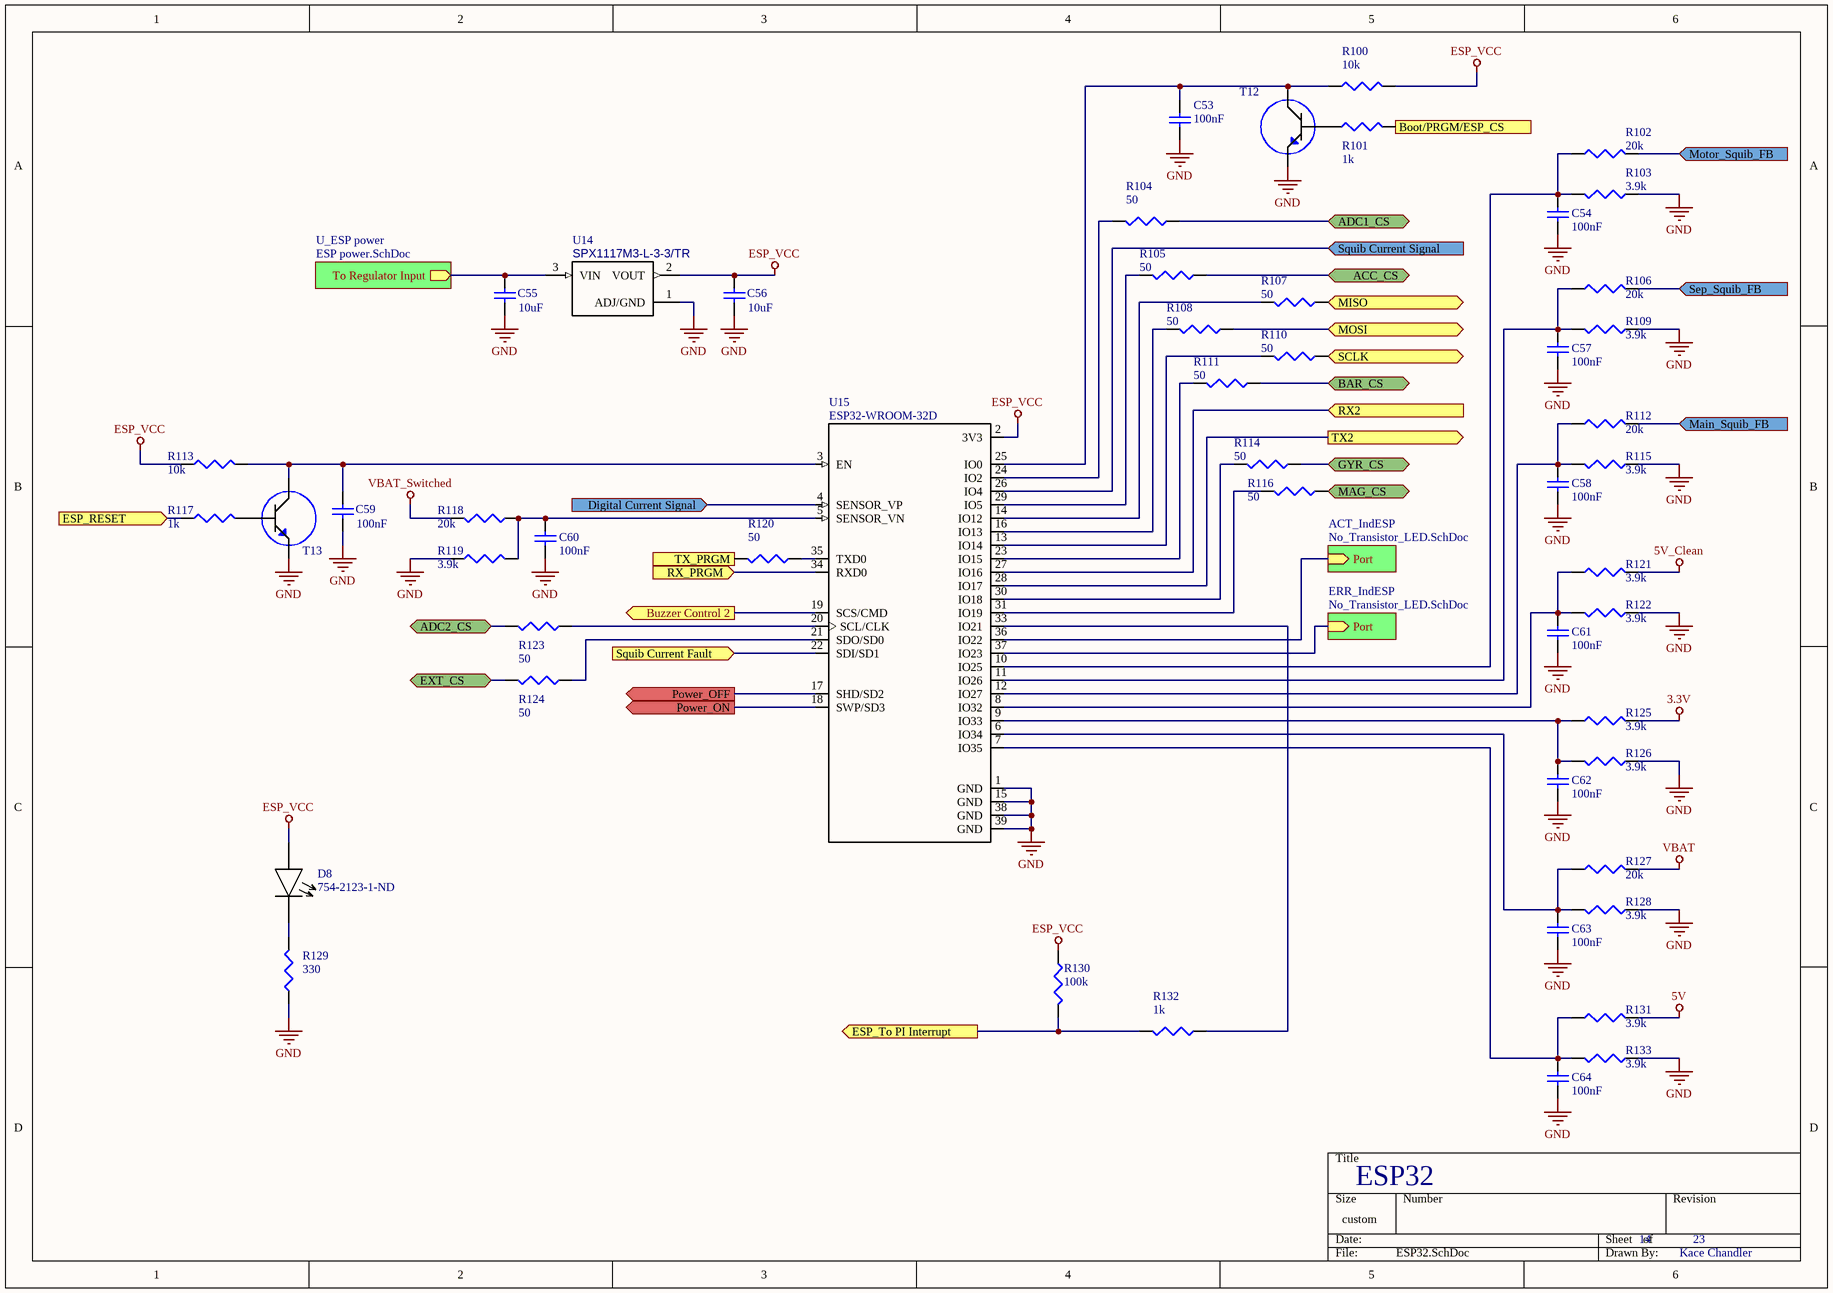
[diagram p15: ESP32.SchDoc]

### Parts
C53  value 100nF  [0805 Footprint]  (hidden comment: Cap)
C54  value 100nF  [0603 Footprint]  (hidden comment: Cap)
C55  value 10uF  [0805 Footprint]  (hidden comment: Cap)
C56  value 10uF  [0805 Footprint]  (hidden comment: Cap)
C57  value 100nF  [0603 Footprint]  (hidden comment: Cap)
C58  value 100nF  [0603 Footprint]  (hidden comment: Cap)
C59  value 100nF  [0805 Footprint]  (hidden comment: Cap)
C60  value 100nF  [0603 Footprint]  (hidden comment: Cap)
C61  value 100nF  [0603 Footprint]  (hidden comment: Cap)
C62  value 100nF  [0603 Footprint]  (hidden comment: Cap)
C63  value 100nF  [0603 Footprint]  (hidden comment: Cap)
C64  value 100nF  [0603 Footprint]  (hidden comment: Cap)
D8  Supplier Part Number 1: 754-2123-1-ND  [0402 footprint]  (hidden comment: LED_R)
R100  value 10k  (hidden comment: Res3)
R101  value 1k  (hidden comment: Res3)
R102  value 20k  (hidden comment: Res3)
R103  value 3.9k  (hidden comment: Res3)
R104  value 50  (hidden comment: Res3)
R105  value 50  (hidden comment: Res3)
R106  value 20k  (hidden comment: Res3)
R107  value 50  (hidden comment: Res3)
R108  value 50  (hidden comment: Res3)
R109  value 3.9k  (hidden comment: Res3)
R110  value 50  (hidden comment: Res3)
R111  value 50  (hidden comment: Res3)
R112  value 20k  (hidden comment: Res3)
R113  value 10k  (hidden comment: Res3)
R114  value 50  (hidden comment: Res3)
R115  value 3.9k  (hidden comment: Res3)
R116  value 50  (hidden comment: Res3)
R117  value 1k  (hidden comment: Res3)
R118  value 20k  (hidden comment: Res3)
R119  value 3.9k  (hidden comment: Res3)
R120  value 50  (hidden comment: Res3)
R121  value 3.9k  (hidden comment: Res3)
R122  value 3.9k  (hidden comment: Res3)
R123  value 50  (hidden comment: Res3)
R124  value 50  (hidden comment: Res3)
R125  value 3.9k  (hidden comment: Res3)
R126  value 3.9k  (hidden comment: Res3)
R127  value 20k  (hidden comment: Res3)
R128  value 3.9k  (hidden comment: Res3)
R129  value 330  (hidden comment: Res3)
R130  value 100k  [J1-0603]  (hidden comment: Res3)
R131  value 3.9k  (hidden comment: Res3)
R132  value 1k  (hidden comment: Res3)
R133  value 3.9k  (hidden comment: Res3)
T12  MMBT2222ALT1  [BJT]  (value not drawn)
T13  MMBT2222ALT1  [BJT]  (value not drawn)
U14  MP: SPX1117M3-L-3-3/TR  [*DPAK229P990X238-4N]  (hidden comment: 3.3V Regulator)
U15  ESP32-WROOM-32D  [*MODULE_ESP32-WROOM-32D]

### Sub-sheets
ACT_IndESP = No_Transistor_LED.SchDoc: Port (in)
ERR_IndESP = No_Transistor_LED.SchDoc: Port (in)
U_ESP power = ESP power.SchDoc: To Regulator Input (out)

### Ports
ACC_CS (bidir), ADC1_CS (bidir), ADC2_CS (bidir), BAR_CS (bidir), Boot/PRGM/ESP_CS (in), Buzzer Control 2 (out), Digital Current Signal (in), ESP_RESET (in), ESP_To PI Interrupt (out), EXT_CS (bidir), GYR_CS (bidir), MAG_CS (bidir), Main_Squib_FB (in), MISO (bidir), MOSI (bidir), Motor_Squib_FB (in), Power_OFF (out), Power_ON (out), RX2 (in), RX_PRGM (in), SCLK (bidir), Sep_Squib_FB (in), Squib Current Fault (in), Squib Current Signal (in), TX2 (out), TX_PRGM (out)

### Nets
3.3V: R125.2
5V: R131.2
5V_Clean: R121.2
ESP_VCC: C56.2 D8.1 R100.1 R113.1 R130.1 U14.2(VOUT) U15.2(3V3)
GND: C53.1 C54.1 C55.1 C56.1 C57.1 C58.1 C59.1 C60.1 C61.1 C62.1 C63.1 C64.1 R103.1 R109.1 R115.1 R119.1 R122.1 R126.1 R128.1 R129.1 R133.1 T12.2(E) T13.2(E) U14.1(ADJ/GND) U15.1(GND) U15.15(GND) U15.38(GND) U15.39(GND)
VBAT: R127.2
VBAT_Switched: R118.2
MISO: R107.1 ; port MISO
MOSI: R108.1 ; port MOSI
SCL: R110.1 ; port SCLK
NetC38_2: U15.4(SENSOR_VP) ; port Digital Current Signal
NetC39_2: U15.26(IO4) ; port Squib Current Signal
NetC53_2: C53.2 R100.2 T12.3(C) U15.25(IO0)
NetC54_2: C54.2 R102.1 R103.2 U15.10(IO25)
NetC55_2: C55.2 U14.3(VIN) ; sheet U_ESP power/To Regulator Input
NetC57_2: C57.2 R106.1 R109.2 U15.11(IO26)
NetC58_2: C58.2 R112.1 R115.2 U15.12(IO27)
NetC59_2: C59.2 R113.2 T13.3(C) U15.3(EN)
NetC60_2: C60.2 R118.1 R119.2 U15.5(SENSOR_VN)
NetC61_2: C61.2 R121.1 R122.2 U15.8(IO32)
NetC62_2: C62.2 R125.1 R126.2 U15.9(IO33)
NetC63_2: C63.2 R127.1 R128.2 U15.6(IO34)
NetC64_2: C64.2 R131.1 R133.2 U15.7(IO35)
NetD1_ESP_ACT_IndESP_1: U15.36(IO22) ; sheet ACT_IndESP/Port
NetD1_ESP_ERR_IndESP_1: U15.37(IO23) ; sheet ERR_IndESP/Port
NetD8_2: D8.2 R129.2
NetJ3_Main_Squib_1: R102.2 ; port Motor_Squib_FB
NetJ3_Motor_Squib_1: R112.2 ; port Main_Squib_FB
NetJ3_Sep_Squib_1: R106.2 ; port Sep_Squib_FB
NetJ15_16: R101.2 ; port Boot/PRGM/ESP_CS
NetJ15_18: R117.1 ; port ESP_RESET
NetJ15_22: R130.2 R132.2 ; port ESP_To PI Interrupt
NetR2_ADC_1_1: R104.1 ; port ADC1_CS
NetR2_ADC_2_1: R123.2 ; port ADC2_CS
NetR16_1: U15.19(SCS/CMD) ; port Buzzer Control 2
NetR64_2: U15.18(SWP/SD3) ; port Power_ON
NetR67_1: U15.17(SHD/SD2) ; port Power_OFF
NetR71_1: R124.2 ; port EXT_CS
NetR72_ESP_UART_Output_1: U15.28(IO17) ; port TX2
NetR73_ESP_UART_Output_1: U15.27(IO16) ; port RX2
NetR79_1: U15.22(SDI/SD1) ; port Squib Current Fault
NetR88_2: R105.1 ; port ACC_CS
NetR89_2: R111.1 ; port BAR_CS
NetR90_2: R114.1 ; port GYR_CS
NetR91_2: R116.1 ; port MAG_CS
NetR101_1: R101.1 T12.1(B)
NetR104_2: R104.2 U15.24(IO2)
NetR105_2: R105.2 U15.29(IO5)
NetR107_2: R107.2 U15.14(IO12)
NetR108_2: R108.2 U15.16(IO13)
NetR110_2: R110.2 U15.13(IO14)
NetR111_2: R111.2 U15.23(IO15)
NetR114_2: R114.2 U15.30(IO18)
NetR116_2: R116.2 U15.31(IO19)
NetR117_2: R117.2 T13.1(B)
NetR120_1: R120.1 U15.35(TXD0)
NetR120_2: R120.2 ; port TX_PRGM
NetR123_1: R123.1 U15.20(SCL/CLK)
NetR124_1: R124.1 U15.21(SDO/SD0)
NetR132_1: R132.1 U15.33(IO21)
NetS2_3: U15.34(RXD0) ; port RX_PRGM

### Library data of the parts
C54-C58 C60-C64 = Cap: Capacitor; Published: 8-Jun-2000; LatestRevisionDate: 17-Jul-2002; LatestRevisionNote: Re-released for DXP Platform.; PackageReference: RAD-0.3; Publisher: Altium Limited; PackageDescription: Radial Cap, Thru-Hole; 2 Leads; 0.3 in Pin Spacing
R100-R133 = Res3: Resistor; Published: 8-Jun-2000; LatestRevisionDate: 29-May-2009; LatestRevisionNote: IPC-7351 Footprint Added.; PackageReference: J1-0603; Publisher: Altium Limited; PackageDescription: Chip Resistor
T12 T13 = BJT NPN: as T5 on sheet ESP32 backup; SnapEDA_Link: https://www.snapeda.com/parts/MMBT2222ALT1/ON%20Semiconductor/view-part/?ref=snap; Price: None; Availability: Unavailable; MP: MMBT2222ALT1; Package: SOT-23 Motorola; Value: *; Supplier 1: Digi-Key; Supplier Part Number 1: MMBT2222ATPMSCT-ND
U14 = 3-3VReg: as U6 on sheet ESP32 backup; Availability: Unavailable; Price: None; Package: SOT-223 Exar; SnapEDA_Link: https://www.snapeda.com/parts/SPX1117M3-L-3-3/TR/MaxLinear%2C%20Inc./view-part/?ref=snap; Value: *; Supplier 1: Digi-Key; Supplier Part Number 1: NCP1117DT33T5GOSCT-ND
U15 = ESP32-WROOM-32D: as U7 on sheet ESP32 backup; SnapEDA_Link: https://www.snapeda.com/parts/ESP32-WROOM-32D/Espressif%20Systems/view-part/?ref=snap; Availability: Unavailable; Package: Module Espressif Systems; Price: None; MP: ESP32-WROOM-32D; Value: *; Supplier 1: Digi-Key; Supplier Part Number 1: 1904-1023-1-ND
D8 = LED_R: Supplier 1: Digi-Key

## Sheet 3 way uart switch.SchDoc: UART Switching
size 203 x 127 mm; DrawnBy: Kace Chandler; DocumentNumber: 18; SheetNumber: 18; SheetTotal: 23
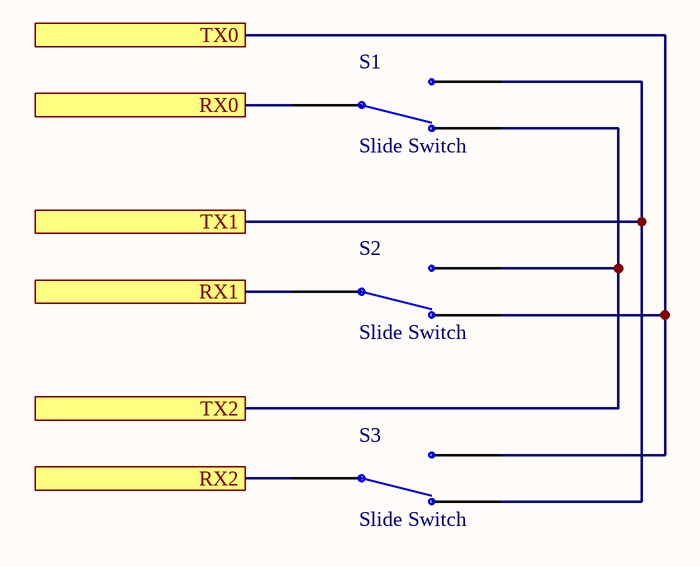
[diagram p16: 3 way uart switch.SchDoc]

### Parts
S1  Slide Switch  [CJS Micro switch]
S2  Slide Switch  [CJS Micro switch]
S3  Slide Switch  [CJS Micro switch]

### Ports
RX0, RX1, RX2, TX0, TX1, TX2

### Nets
NetJ15_10: S1.3 ; port RX0
NetR72_UART_EXT_1: S1.1 S2.2 ; port TX2
NetR73_UART_EXT_1: S3.3 ; port RX2
NetR87_1: S2.1 S3.2 ; port TX0
NetR120_2: S1.2 S3.1 ; port TX1
NetS2_3: S2.3 ; port RX1

### Library data of the parts
S1-S3 = Screw Switch: Supplier 1: Digi-Key; Supplier Part Number 1: 7813J-051ECT-ND

## Sheet Squib_Managment.SchDoc: Squib Management
size 203 x 127 mm; DrawnBy: Kace Chandler; DocumentNumber: 9; SheetNumber: 9; SheetTotal: 23
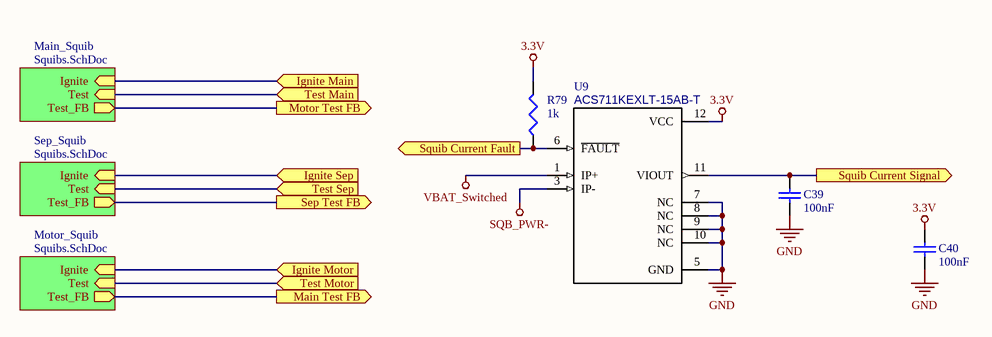
[diagram p17: Squib_Managment.SchDoc]

### Parts
C39  value 100nF  [0805 Footprint]  (hidden comment: Cap)
C40  value 100nF  [0805 Footprint]  (hidden comment: Cap)
R79  value 1k  (hidden comment: Res3)
U9  ACS711KEXLT-15AB-T  [*SENSOR_ACS711KEXLT-15AB-T]

### Sub-sheets
Main_Squib = Squibs.SchDoc: Ignite (in), Test (in), Test_FB (out)
Motor_Squib = Squibs.SchDoc: Ignite (in), Test (in), Test_FB (out)
Sep_Squib = Squibs.SchDoc: Ignite (in), Test (in), Test_FB (out)

### Ports
Ignite Main (in), Ignite Motor (in), Ignite Sep (in), Main Test FB (out), Motor Test FB (out), Sep Test FB (out), Squib Current Fault (out), Squib Current Signal (out), Test Main (in), Test Motor (in), Test Sep (in)

### Nets
3.3V: C40.2 R79.2 U9.12(VCC)
GND: C39.1 C40.1 U9.5(GND) U9.7(NC) U9.8(NC) U9.9(NC) U9.10(NC)
SQB_PWR-: U9.3(IP-)
VBAT_Switched: U9.1(IP+)
NetC39_2: C39.2 U9.11(VIOUT) ; port Squib Current Signal
NetJ3_Main_Squib_1: port Motor Test FB, sheet Main_Squib/Test_FB
NetJ3_Motor_Squib_1: port Main Test FB, sheet Motor_Squib/Test_FB
NetJ3_Sep_Squib_1: port Sep Test FB, sheet Sep_Squib/Test_FB
NetJ15_29: port Test Motor, sheet Motor_Squib/Test
NetJ15_31: port Test Main, sheet Main_Squib/Test
NetJ15_32: port Test Sep, sheet Sep_Squib/Test
NetJ15_35: port Ignite Main, sheet Main_Squib/Ignite
NetJ15_36: port Ignite Sep, sheet Sep_Squib/Ignite
NetJ15_37: port Ignite Motor, sheet Motor_Squib/Ignite
NetR79_1: R79.1 U9.6(~{FAULT}) ; port Squib Current Fault

### Library data of the parts
C39 C40 = Cap: Capacitor; Published: 8-Jun-2000; LatestRevisionDate: 17-Jul-2002; LatestRevisionNote: Re-released for DXP Platform.; PackageReference: RAD-0.3; Publisher: Altium Limited; PackageDescription: Radial Cap, Thru-Hole; 2 Leads; 0.3 in Pin Spacing
R79 = Res3: Resistor; Published: 8-Jun-2000; LatestRevisionDate: 29-May-2009; LatestRevisionNote: IPC-7351 Footprint Added.; PackageReference: J1-0603; Publisher: Altium Limited; PackageDescription: Chip Resistor
U9 = 31A current sensor: Hall Effect Linear Current Sensor with Overcurrent Fault Output for <100 V Isolation Applications; MF: Allegro MicroSystems LLC; Package: PowerWFQFN-12 Allegro MicroSystems LLC; Price: None; SnapEDA_Link: https://www.snapeda.com/parts/ACS711KEXLT-15AB-T/Allegro%20MicroSystems%20LLC/view-part/?ref=snap; MP: ACS711KEXLT-15AB-T; Availability: Unavailable; Value: *; Supplier 1: Digi-Key; Supplier Part Number 1: 620-1481-1-ND